# Altium project WL1800-E-D001-PrinterC Rev.2.0.PrjPCB
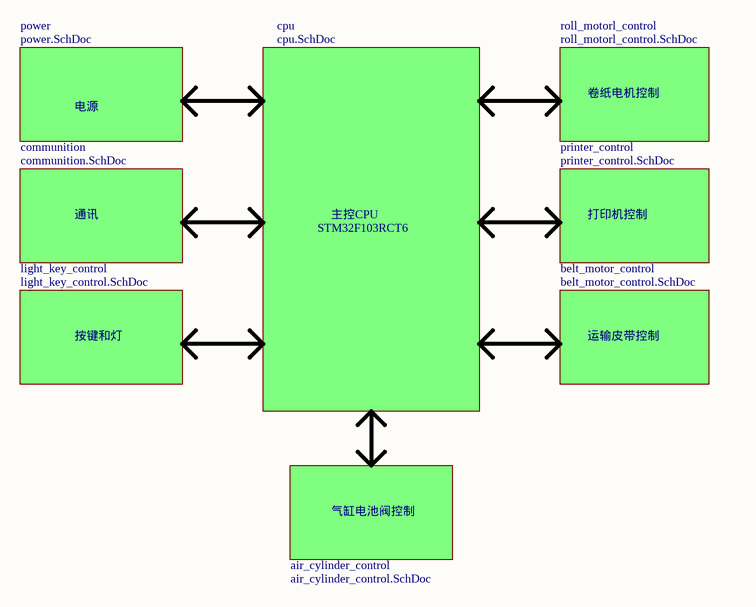
[diagram p0: WL1800-E-D001-PrinterC Rev.2.0.SchDoc]
9 sheets, 280 parts. Net scope: global (net labels, ports and power ports of the same name join across sheets).
Board file: WL1800-E-D001-PrinterC Rev.2.0.PcbDoc
Sheets:
  WL1800-E-D001-PrinterC Rev.2.0.SchDoc
    cpu = cpu.SchDoc
    roll_motorl_control = roll_motorl_control.SchDoc
    belt_motor_control = belt_motor_control.SchDoc
    communition = communition.SchDoc
    printer_control = printer_control.SchDoc
    light_key_control = light_key_control.SchDoc
    power = power.SchDoc
    air_cylinder_control = air_cylinder_control.SchDoc

## Sheet WL1800-E-D001-PrinterC Rev.2.0.SchDoc
size A4; DocumentNumber: 1; Revision: V1.0; SheetNumber: 1; SheetTotal: 9

### Sub-sheets
air_cylinder_control = air_cylinder_control.SchDoc: no entries
belt_motor_control = belt_motor_control.SchDoc: no entries
communition = communition.SchDoc: no entries
cpu = cpu.SchDoc: no entries
light_key_control = light_key_control.SchDoc: no entries
power = power.SchDoc: no entries
printer_control = printer_control.SchDoc: no entries
roll_motorl_control = roll_motorl_control.SchDoc: no entries

### Notes on the sheet
- 电源
- 卷纸电机控制
- 通讯
- STM32F103RCT6
- 主控CPU
- 打印机控制
- 按键和灯
- 运输皮带控制
- 气缸电池阀控制
- :

## Sheet cpu.SchDoc
size A3; DocumentNumber: 3; Revision: V1.0; SheetNumber: 3; SheetTotal: 9
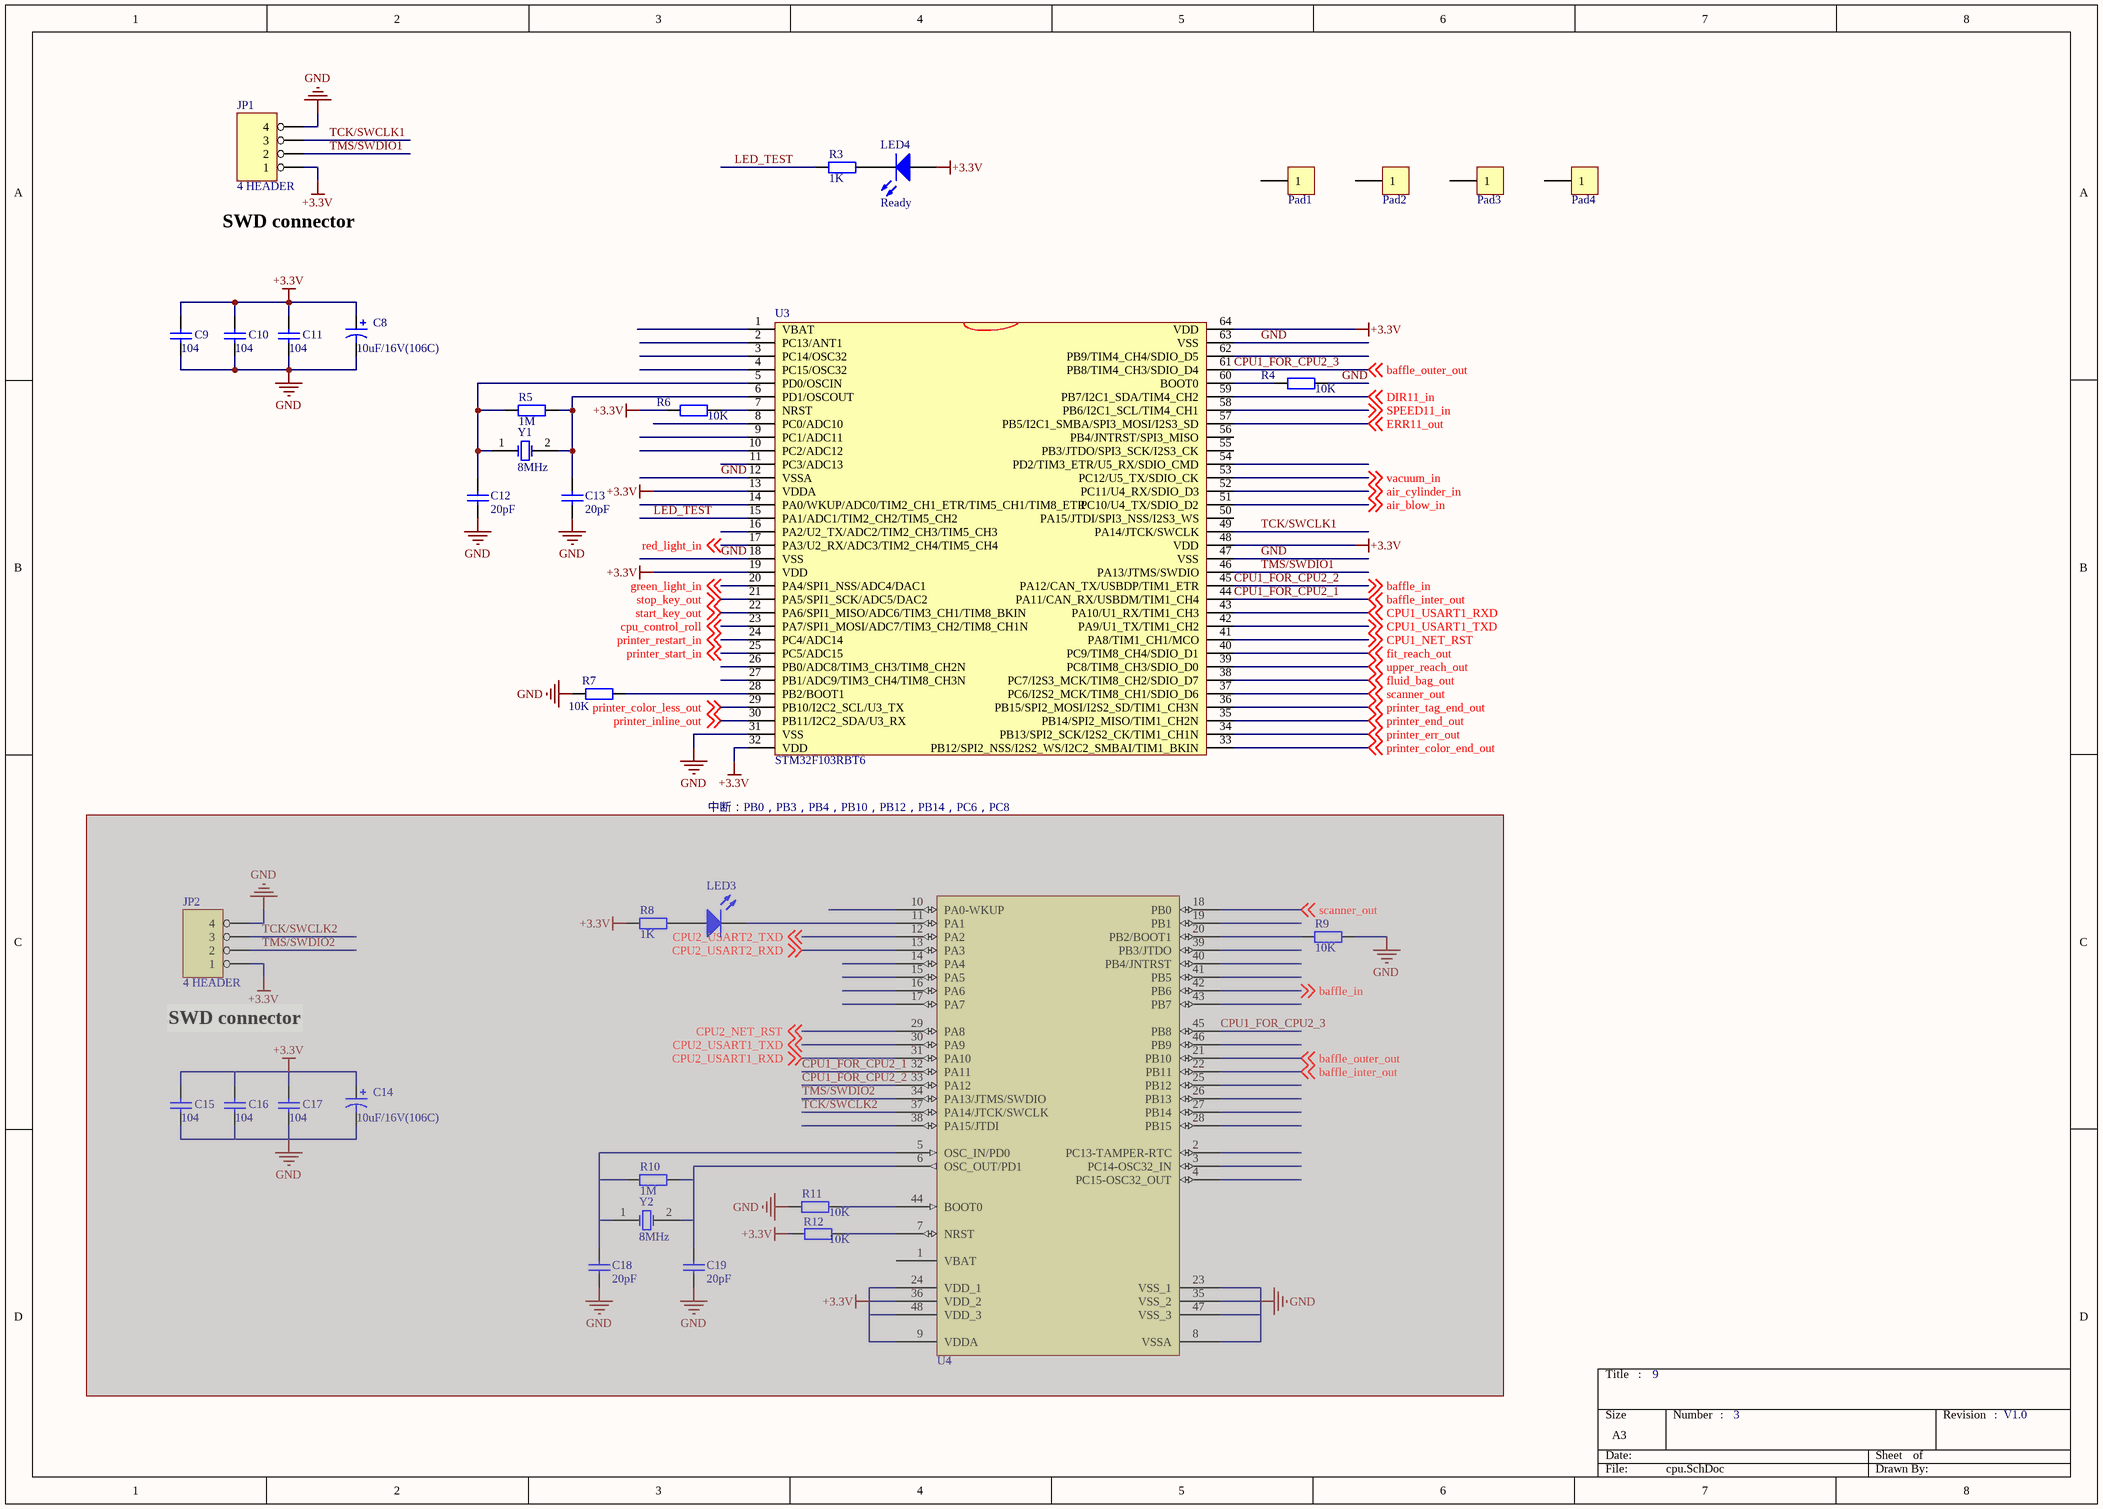
[diagram p1: cpu.SchDoc]

### Parts
(Parts that share a designator on the sheet are numbered #1, #2 ... from top to bottom, then left to right.)
C8  value 10uF/16V(106C)  [CAP A-3216]  (hidden comment: Cap Pol3)
C9  value 104  [0805]  (hidden comment: Cap)
C10  value 104  [0805]  (hidden comment: Cap)
C11  value 104  [0805]  (hidden comment: Cap)
C12  value 20pF  [0805]  (hidden comment: Cap)
C13  value 20pF  [0805]  (hidden comment: Cap)
C14  value 10uF/16V(106C)  [CAP A-3216]  (hidden comment: Cap Pol3)  (masked out: inside a compile mask, not in the netlist)
C15  value 104  [0805]  (hidden comment: Cap)  (masked out: inside a compile mask, not in the netlist)
C16  value 104  [0805]  (hidden comment: Cap)  (masked out: inside a compile mask, not in the netlist)
C17#1  value 104  [0805]  (hidden comment: Cap)  (masked out: inside a compile mask, not in the netlist)
C18#1  value 20pF  [0805]  (hidden comment: Cap)  (masked out: inside a compile mask, not in the netlist)
C19#1  value 20pF  [0805]  (hidden comment: Cap)  (masked out: inside a compile mask, not in the netlist)
JP1  4 HEADER  [CON4_1.5]
JP2  4 HEADER  [CON4_1.5]  (masked out: inside a compile mask, not in the netlist)
LED3  (no value)  [LED-0805]  (masked out: inside a compile mask, not in the netlist)
LED4  Ready  [LED-0805]
Pad1  Pad  [pad35]  (value not drawn)
Pad2  Pad  [pad35]  (value not drawn)
Pad3  Pad  [pad35]  (value not drawn)
Pad4  Pad  [pad35]  (value not drawn)
R3  value 1K  [0805]  (hidden comment: Res2)
R4  value 10K  [0805]  (hidden comment: Res2)
R5  value 1M  [0805]  (hidden comment: Res2)
R6  value 10K  [0805]  (hidden comment: Res2)
R7  value 10K  [0805]  (hidden comment: Res2)
R8  value 1K  [0805]  (hidden comment: Res2)  (masked out: inside a compile mask, not in the netlist)
R9#1  value 10K  [0805]  (hidden comment: Res2)  (masked out: inside a compile mask, not in the netlist)
R10  value 1M  [0805]  (hidden comment: Res2)  (masked out: inside a compile mask, not in the netlist)
R11#1  value 10K  [0805]  (hidden comment: Res2)  (masked out: inside a compile mask, not in the netlist)
R12#1  value 10K  [0805]  (hidden comment: Res2)  (masked out: inside a compile mask, not in the netlist)
U3  STM32F103RBT6  [LQFP64]
U4  STM32F103C8T6  [LQFP48]  (value not drawn)  (masked out: inside a compile mask, not in the netlist)
Y1  8MHz  [XTAL_US]
Y2  8MHz  [XTAL_US]  (masked out: inside a compile mask, not in the netlist)

### Nets
+3.3V: C8.1 C9.2 C10.2 C11.2 JP1.1 LED4.1(A) R6.1 U3.13(VDDA) U3.19(VDD) U3.32(VDD) U3.48(VDD) U3.64(VDD)
GND: C8.2 C9.1 C10.1 C11.1 C12.1 C13.1 JP1.4 R4.2 R7.1 U3.12(VSSA) U3.18(VSS) U3.31(VSS) U3.47(VSS) U3.63(VSS)
air_blow_in: U3.51(PC10/U4_TX/SDIO_D2) ; off-sheet air_blow_in
air_cylinder_in: U3.52(PC11/U4_RX/SDIO_D3) ; off-sheet air_cylinder_in
CPU1_FOR_CPU2_1: U3.44(PA11/CAN_RX/USBDM/TIM1_CH4) ; off-sheet baffle_inter_out  [also labelled baffle_inter_out]
CPU1_FOR_CPU2_2: U3.45(PA12/CAN_TX/USBDP/TIM1_ETR) ; off-sheet baffle_in  [also labelled baffle_in]
CPU1_FOR_CPU2_3: U3.61(PB8/TIM4_CH3/SDIO_D4) ; off-sheet baffle_outer_out  [also labelled baffle_outer_out]
CPU1_NET_RST: U3.41(PA8/TIM1_CH1/MCO) ; off-sheet CPU1_NET_RST
CPU1_USART1_RXD: U3.43(PA10/U1_RX/TIM1_CH3) ; off-sheet CPU1_USART1_RXD
CPU1_USART1_TXD: U3.42(PA9/U1_TX/TIM1_CH2) ; off-sheet CPU1_USART1_TXD
cpu_control_roll: U3.23(PA7/SPI1_MOSI/ADC7/TIM3_CH2/TIM8_CH1N) ; off-sheet cpu_control_roll
DIR11_in: U3.59(PB7/I2C1_SDA/TIM4_CH2) ; off-sheet DIR11_in
ERR11_out: U3.57(PB5/I2C1_SMBA/SPI3_MOSI/I2S3_SD) ; off-sheet ERR11_out
fit_reach_out: U3.40(PC9/TIM8_CH4/SDIO_D1) ; off-sheet fit_reach_out
fluid_bag_out: U3.38(PC7/I2S3_MCK/TIM8_CH2/SDIO_D7) ; off-sheet fluid_bag_out
green_light_in: U3.20(PA4/SPI1_NSS/ADC4/DAC1) ; off-sheet green_light_in
LED_TEST: R3.1 U3.15(PA1/ADC1/TIM2_CH2/TIM5_CH2)
printer_color_end_out: U3.33(PB12/SPI2_NSS/I2S2_WS/I2C2_SMBAI/TIM1_BKIN) ; off-sheet printer_color_end_out
printer_color_less_out: U3.29(PB10/I2C2_SCL/U3_TX) ; off-sheet printer_color_less_out
printer_end_out: U3.35(PB14/SPI2_MISO/TIM1_CH2N) ; off-sheet printer_end_out
printer_err_out: U3.34(PB13/SPI2_SCK/I2S2_CK/TIM1_CH1N) ; off-sheet printer_err_out
printer_inline_out: U3.30(PB11/I2C2_SDA/U3_RX) ; off-sheet printer_inline_out
printer_restart_in: U3.24(PC4/ADC14) ; off-sheet printer_restart_in
printer_start_in: U3.25(PC5/ADC15) ; off-sheet printer_start_in
printer_tag_end_out: U3.36(PB15/SPI2_MOSI/I2S2_SD/TIM1_CH3N) ; off-sheet printer_tag_end_out
red_light_in: U3.17(PA3/U2_RX/ADC3/TIM2_CH4/TIM5_CH4) ; off-sheet red_light_in
scanner_out: U3.37(PC6/I2S2_MCK/TIM8_CH1/SDIO_D6) ; off-sheet scanner_out
SPEED11_in: U3.58(PB6/I2C1_SCL/TIM4_CH1) ; off-sheet SPEED11_in
start_key_out: U3.22(PA6/SPI1_MISO/ADC6/TIM3_CH1/TIM8_BKIN) ; off-sheet start_key_out
stop_key_out: U3.21(PA5/SPI1_SCK/ADC5/DAC2) ; off-sheet stop_key_out
TCK/SWCLK1: JP1.3 U3.49(PA14/JTCK/SWCLK)
TMS/SWDIO1: JP1.2 U3.46(PA13/JTMS/SWDIO)
upper_reach_out: U3.39(PC8/TIM8_CH3/SDIO_D0) ; off-sheet upper_reach_out
vacuum_in: U3.53(PC12/U5_TX/SDIO_CK) ; off-sheet vacuum_in
NetC12_2: C12.2 R5.1 U3.5(PD0/OSCIN) Y1.1(OSC1)
NetC13_2: C13.2 R5.2 U3.6(PD1/OSCOUT) Y1.2(OSC2)
NetLED4_2: LED4.2(K) R3.2
NetR4_1: R4.1 U3.60(BOOT0)
NetR6_2: R6.2 U3.7(NRST)
NetR7_2: R7.2 U3.28(PB2/BOOT1)

Not connected (* = marked no-connect by the designer): Pad1 1; Pad2 1; Pad3 1; Pad4 1; U3 1(VBAT) 2(PC13/ANT1) 3(PC14/OSC32) 4(PC15/OSC32) 8(PC0/ADC10) 9(PC1/ADC11) 10(PC2/ADC12) 11(PC3/ADC13) 14(PA0/WKUP/ADC0/TIM2_CH1_ETR/TIM5_CH1/TIM8_ETR) 16(PA2/U2_TX/ADC2/TIM2_CH3/TIM5_CH3) 26(PB0/ADC8/TIM3_CH3/TIM8_CH2N) 27(PB1/ADC9/TIM3_CH4/TIM8_CH3N) 50(PA15/JTDI/SPI3_NSS/I2S3_WS) 54(PD2/TIM3_ETR/U5_RX/SDIO_CMD) 55(PB3/JTDO/SPI3_SCK/I2S3_CK) 56(PB4/JNTRST/SPI3_MISO) 62(PB9/TIM4_CH4/SDIO_D5)

### Notes on the sheet
- (near JP1) SWD connector
- 中断：PB0，PB3，PB4，PB10，PB12，PB14，PC6，PC8
- (near JP2) SWD connector
- :

### Library data of the parts
C8 C14 = Cap Pol3: Polarized Capacitor (Surface Mount); Published: 8-Jun-2000; LatestRevisionDate: 17-Jul-2002; LatestRevisionNote: Re-released for DXP Platform.; PackageReference: C0805; Publisher: Altium Limited
C9-C13 C15 C16 C17#1 C18#1 C19#1 = Cap: Capacitor; Published: 8-Jun-2000; LatestRevisionDate: 17-Jul-2002; LatestRevisionNote: Re-released for DXP Platform.; Publisher: Altium Limited
  C9-C11 C15 C16 C17#1: PackageReference: RAD-0.3
JP1 JP2 = 4 HEADER: 4 Pin Header
LED3 LED4 = LED2: Typical RED, GREEN, YELLOW, AMBER GaAs LED; Published: 8-Jun-2000; LatestRevisionDate: 17-Jul-2002; LatestRevisionNote: Re-released for DXP Platform.; PackageDocument: Feb-2002; PackageReference: 3.2X1.6X1.1; Publisher: Altium Limited
R3-R8 R9#1 R10 R11#1 R12#1 = Res2: Resistor; Published: 8-Jun-2000; LatestRevisionDate: 17-Jul-2002; LatestRevisionNote: Re-released for DXP Platform.; Publisher: Altium Limited
  R3 R8: PackageReference: AXIAL-0.4
U3 = STM32F103RDT6
Y1 Y2 = XTAL: Crystal Oscillator; Published: 8-Jun-2000; LatestRevisionDate: 17-Jul-2002; LatestRevisionNote: Re-released for DXP Platform.; Publisher: Altium Limited

## Sheet roll_motorl_control.SchDoc
size A3; DocumentNumber: 7; Revision: V1.0; SheetNumber: 7; SheetTotal: 9
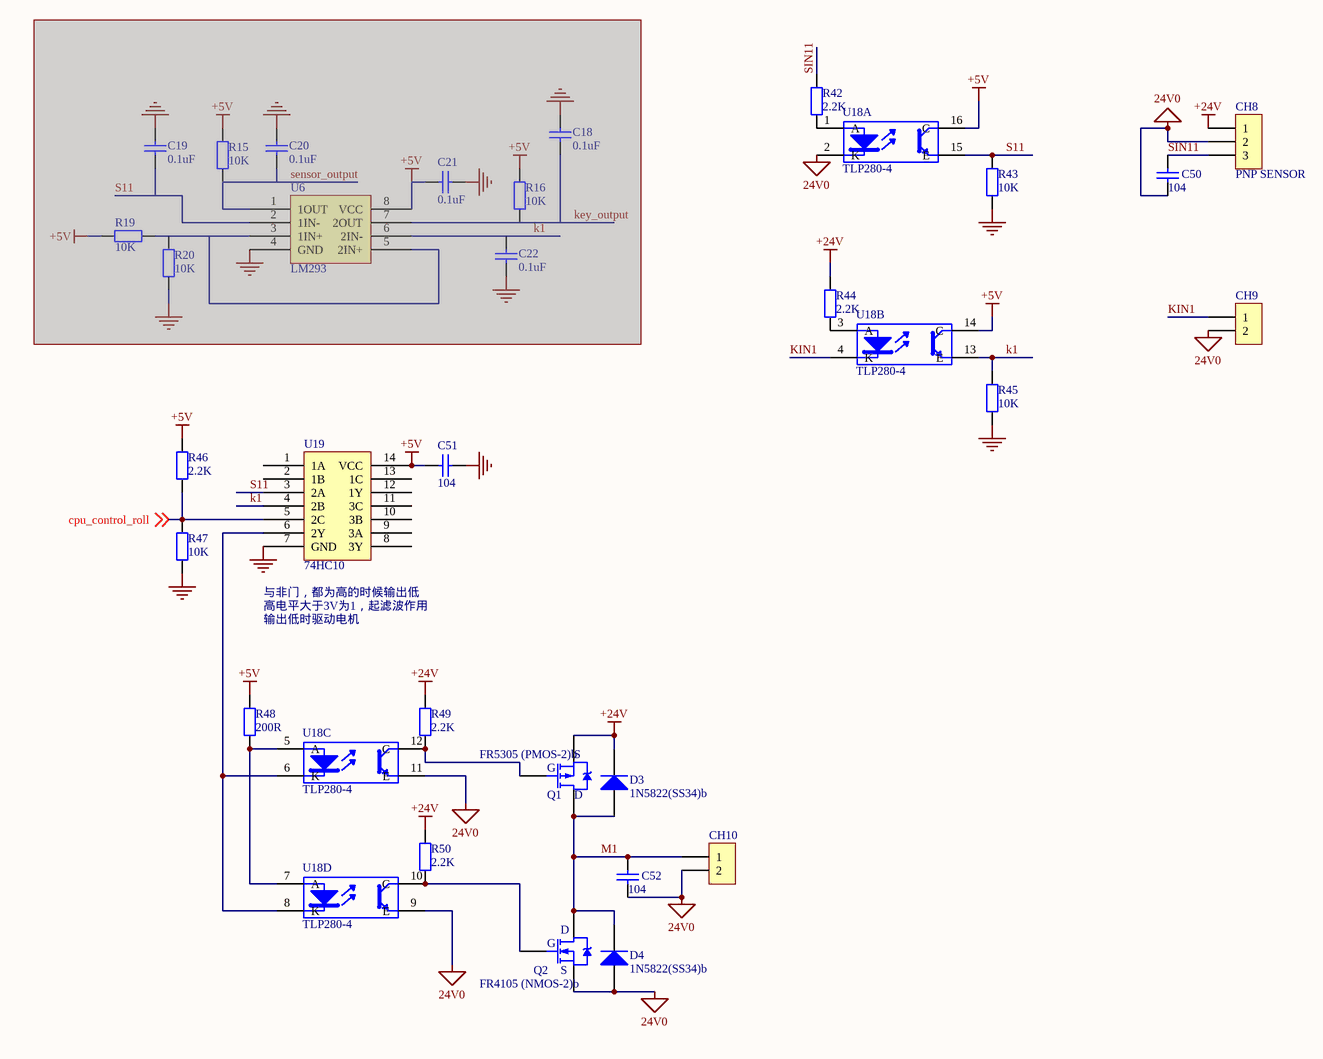
[diagram p2: roll_motorl_control.SchDoc]

### Parts
(Parts that share a designator on the sheet are numbered #1, #2 ... from top to bottom, then left to right.)
C18#2  value 0.1uF  [0805]  (hidden comment: Cap)  (masked out: inside a compile mask, not in the netlist)
C19#2  value 0.1uF  [0805]  (hidden comment: Cap)  (masked out: inside a compile mask, not in the netlist)
C20#1  value 0.1uF  [0805]  (hidden comment: Cap)  (masked out: inside a compile mask, not in the netlist)
C21#1  value 0.1uF  [0805]  (hidden comment: Cap)  (masked out: inside a compile mask, not in the netlist)
C22#1  value 0.1uF  [0805]  (hidden comment: Cap)  (masked out: inside a compile mask, not in the netlist)
C50  value 104  [0805]  (hidden comment: Capb)
C51  value 104  [0805]  (hidden comment: Cap)
C52  value 104  [0805]  (hidden comment: Capb)
CH8  HEADER1X3  [CH3.96-3PIN]  (value not drawn)
CH9  HEADER1X2  [CH3.96-2PIN]  (value not drawn)
CH10  HEADER1X2  [CH3.96-2PIN]  (value not drawn)
D3  1N5822(SS34)b  [SMA]
D4  1N5822(SS34)b  [SMA]
Q1  FR5305 (PMOS-2)b  [TO-252]
Q2  FR4105 (NMOS-2)b  [TO-252]
R15#1  value 10K  [0805]  (hidden comment: Res2)  (masked out: inside a compile mask, not in the netlist)
R16#1  value 10K  [0805]  (hidden comment: Res2)  (masked out: inside a compile mask, not in the netlist)
R19#1  value 10K  [0805]  (hidden comment: Res2)  (masked out: inside a compile mask, not in the netlist)
R20#1  value 10K  [0805]  (hidden comment: Res2)  (masked out: inside a compile mask, not in the netlist)
R42  value 2.2K  [0805]  (hidden comment: Res2)
R43  value 10K  [0805]  (hidden comment: Res2)
R44  value 2.2K  [0805]  (hidden comment: Res2)
R45  value 10K  [0805]  (hidden comment: Res2)
R46  value 2.2K  [0805]  (hidden comment: Res2)
R47  value 10K  [0805]  (hidden comment: Res2)
R48  value 200R  [0805]  (hidden comment: Res2)
R49  value 2.2K  [0805]  (hidden comment: Res2)
R50  value 2.2K  [0805]  (hidden comment: Res2)
U6#1  LM293  [SOP8-OP27]  (masked out: inside a compile mask, not in the netlist)
U18  TLP280-4  [SO16]  (parts A,B,C,D of 4)
U19  74HC10  [SO14]

### Nets
24V0: C50.1 C52.1 CH8.2 CH9.2 CH10.2 D4.1(A) Q2.3(S) U18.2(K) U18.9(E) U18.11(E)
+5V: C51.2 R46.1 R48.1 U18.14(C) U18.16(C) U19.14(VCC)
+24V: CH8.1 D3.2(K) Q1.3(S) R44.1 R49.1 R50.1
GND: C51.1 R43.2 R45.2 R47.2 U19.7(GND)
cpu_control_roll: R46.2 R47.1 U19.5(2C) ; off-sheet cpu_control_roll
k1: R45.1 U18.13(E) U19.4(2B)
KIN1: CH9.1 U18.4(K)
M1: C52.2 CH10.1 D3.1(A) D4.2(K) Q1.2(D) Q2.2(D)
S11: R43.1 U18.15(E) U19.3(2A)
SIN11: C50.2 CH8.3 R42.1
NetQ1_1: Q1.1(G) R49.2 U18.12(C)
NetQ2_1: Q2.1(G) R50.2 U18.10(C)
NetR42_2: R42.2 U18.1(A)
NetR44_2: R44.2 U18.3(A)
NetR48_2: R48.2 U18.5(A) U18.7(A)
NetU18_6: U18.6(K) U18.8(K) U19.6(2Y)

Not connected (* = marked no-connect by the designer): U19 1(1A) 2(1B) 8(3Y) 9(3A) 10(3B) 11(3C) 12(1Y) 13(1C)

### Notes on the sheet
- (near U19) 与非门，都为高的时候输出低
- 高电平大于3V为1，起滤波作用
- 输出低时驱动电机
- (near Q1) G
- (near Q1) S
- (near Q1) D
- (near Q2) G
- (near Q2) D
- (near Q2) S
- :
- (in symbol HEADER1X3) PNP SENSOR

### Library data of the parts
C18#2 C19#2 C20#1 C21#1 C22#1 C50-C52 = Cap: Capacitor; Published: 8-Jun-2000; LatestRevisionDate: 17-Jul-2002; LatestRevisionNote: Re-released for DXP Platform.; PackageReference: RAD-0.3; Publisher: Altium Limited
D3 D4 = Diode 1N4148: High Conductance Fast Diode; Published: 8-Jun-2000; LatestRevisionDate: 17-Jul-2002; LatestRevisionNote: Re-released for DXP Platform.; DatasheetDocument: 1997; PackageReference: DO-35; Publisher: Altium Limited; Code_JEDEC: DO-204-AH; ComponentLink1Description: Manufacturer Link; ComponentLink1URL: http://www.fairchildsemi.com/; ComponentLink2Description: Datasheet; ComponentLink2URL: http://www.fairchildsemi.com/ds/1N%2F1N4148.pdf
Q1 = PMOS-2: P-Channel Power MOSFET; Note: Pin 4 not drawn and electrically connected to Pin 2.; Published: 8-Jun-2000; LatestRevisionDate: 17-Jul-2002; LatestRevisionNote: Re-released for DXP Platform.; DatasheetDocument: PD-9.390D; PackageReference: TO-220AB; Publisher: Altium Limited; Code_JEDEC: TO-220-AB; ComponentLink1Description: Manufacturer Link; ComponentLink1URL: http://www.irf.com/
Q2 = NMOS-2: N-Channel Power MOSFET; Note: Pin 2 is electrically connected to pin 4.; Published: 8-Jun-2000; LatestRevisionDate: 17-Jul-2002; LatestRevisionNote: Re-released for DXP Platform.; DatasheetDocument: PD-9.814; PackageReference: TO-220AB; Publisher: Altium Limited; Code_JEDEC: TO-220-AB; ComponentLink1Description: Manufacturer Link; ComponentLink1URL: http://www.irf.com/
R15#1 R16#1 R19#1 R20#1 R42-R50 = Res2: Resistor; Published: 8-Jun-2000; LatestRevisionDate: 17-Jul-2002; LatestRevisionNote: Re-released for DXP Platform.; PackageReference: AXIAL-0.4; Publisher: Altium Limited
U18 = TLP521-4
U19 = 74HC10: three input nand gain

## Sheet belt_motor_control.SchDoc
size A3; DocumentNumber: 5; Revision: V1.0; SheetNumber: 5; SheetTotal: 9
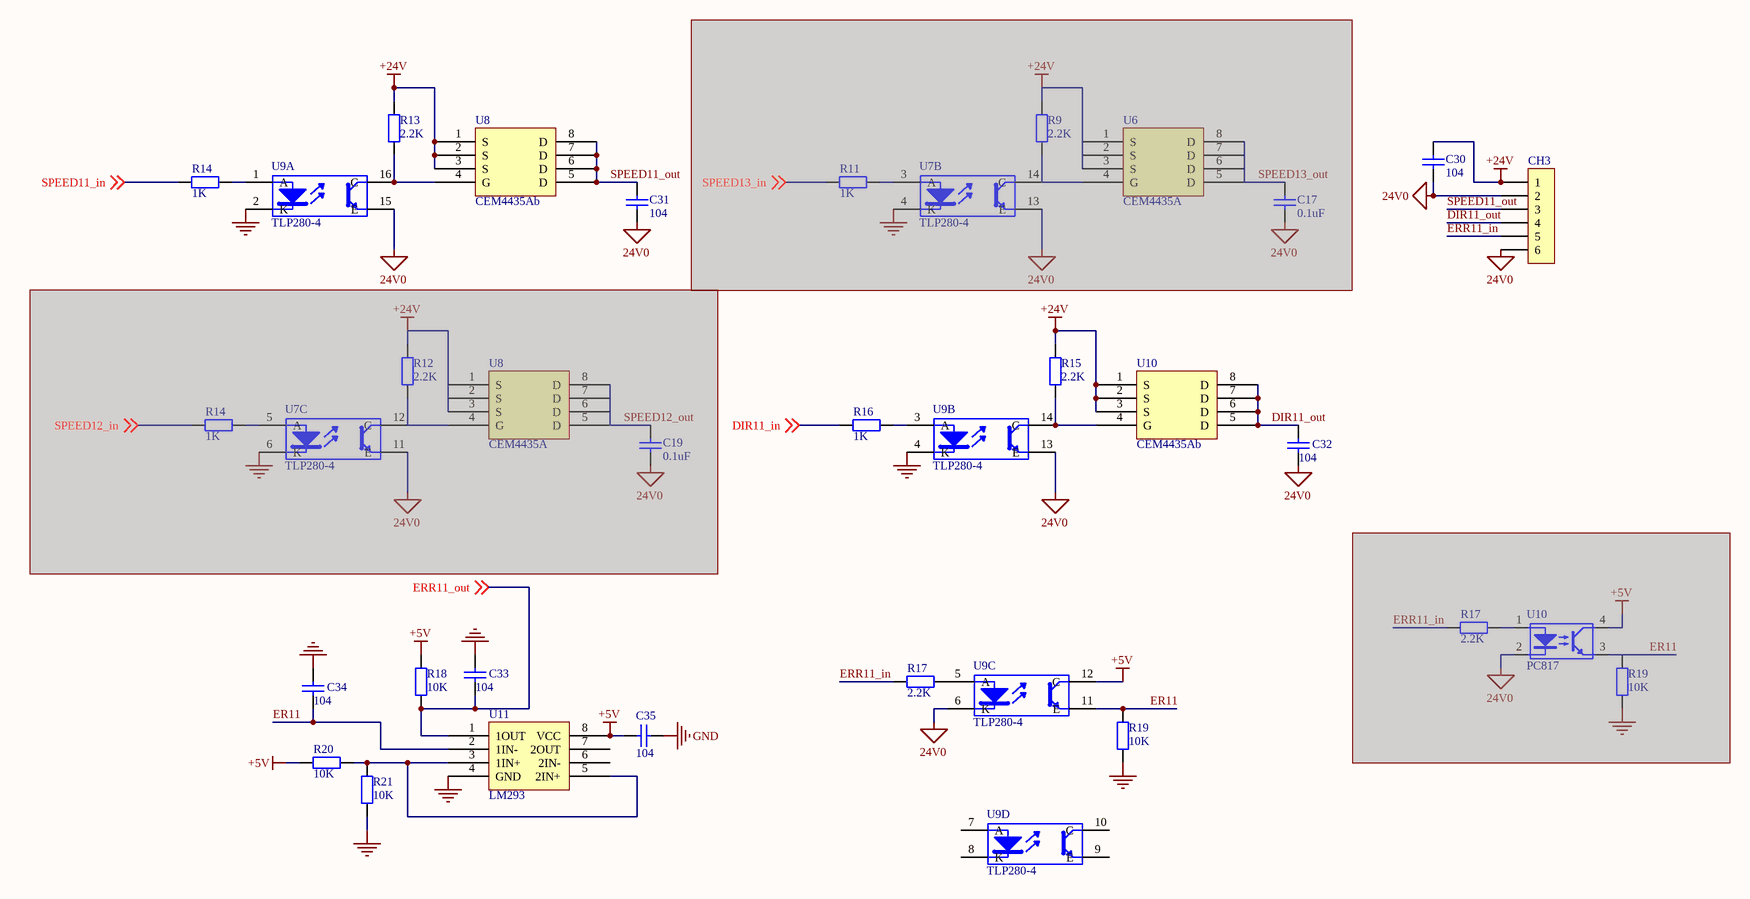
[diagram p3: belt_motor_control.SchDoc]

### Parts
(Parts that share a designator on the sheet are numbered #1, #2 ... from top to bottom, then left to right.)
C17#2  value 0.1uF  [0805]  (hidden comment: Cap)  (masked out: inside a compile mask, not in the netlist)
C19#3  value 0.1uF  [0805]  (hidden comment: Cap)  (masked out: inside a compile mask, not in the netlist)
C30  value 104  [0805]  (hidden comment: Capb)
C31  value 104  [0805]  (hidden comment: Capb)
C32  value 104  [0805]  (hidden comment: Capb)
C33  value 104  [0805]  (hidden comment: Cap)
C34  value 104  [0805]  (hidden comment: Cap)
C35  value 104  [0805]  (hidden comment: Cap)
CH3  HEADER1X6  [CH3.96-6PIN]  (value not drawn)
R9#2  value 2.2K  [0805]  (hidden comment: Res2)  (masked out: inside a compile mask, not in the netlist)
R11#2  value 1K  [0805]  (hidden comment: Res2)  (masked out: inside a compile mask, not in the netlist)
R12#2  value 2.2K  [0805]  (hidden comment: Res2)  (masked out: inside a compile mask, not in the netlist)
R13  value 2.2K  [0805]  (hidden comment: Res2)
R14#1  value 1K  [0805]  (hidden comment: Res2)
R14#2  value 1K  [0805]  (hidden comment: Res2)  (masked out: inside a compile mask, not in the netlist)
R15#2  value 2.2K  [0805]  (hidden comment: Res2)
R16#2  value 1K  [0805]  (hidden comment: Res2)
R17#1  value 2.2K  [0805]  (hidden comment: Res2)  (masked out: inside a compile mask, not in the netlist)
R17#2  value 2.2K  [0805]  (hidden comment: Res2)
R18  value 10K  [0805]  (hidden comment: Res2)
R19#2  value 10K  [0805]  (hidden comment: Res2)  (masked out: inside a compile mask, not in the netlist)
R19#3  value 10K  [0805]  (hidden comment: Res2)
R20#2  value 10K  [0805]  (hidden comment: Res2)
R21  value 10K  [0805]  (hidden comment: Res2)
U6#2  CEM4435A  [SOP8-OP27]  (masked out: inside a compile mask, not in the netlist)
U7#1  TLP280-4  [SO16]  (parts B,C of 4)  (masked out: inside a compile mask, not in the netlist)
U8#1  CEM4435Ab  [SOP8-OP27]
U8#2  CEM4435A  [SOP8-OP27]  (masked out: inside a compile mask, not in the netlist)
U9  TLP280-4  [SO16]  (parts A,B,C,D of 4)
U10#1  CEM4435Ab  [SOP8-OP27]
U10#2  PC817  [SOP4_127]  (masked out: inside a compile mask, not in the netlist)
U11  LM293  [SOP8-OP27]

### Nets
24V0: C30.2 C31.2 C32.1 CH3.2 CH3.6 U9.6(K) U9.13(E) U9.15(E)
+5V: C35.2 R18.1 R20#2.1 U9.12(C) U11.8(VCC)
+24V: C30.1 CH3.1 R13.2 R15#2.1 U8#1.1(S) U8#1.2(S) U8#1.3(S) U10#1.1(S) U10#1.2(S) U10#1.3(S)
GND: C33.2 C34.2 C35.1 R19#3.1 R21.2 U9.2(K) U9.4(K) U11.4(GND)
DIR11_in: R16#2.1 ; off-sheet DIR11_in
DIR11_out: C32.2 CH3.4 U10#1.5(D) U10#1.6(D) U10#1.7(D) U10#1.8(D)
ER11: C34.1 R19#3.2 U9.11(E) U11.2(1IN-)
ERR11_in: CH3.5 R17#2.1
ERR11_out: C33.1 R18.2 U11.1(1OUT) ; off-sheet ERR11_out
SPEED11_in: R14#1.1 ; off-sheet SPEED11_in
SPEED11_out: C31.1 CH3.3 U8#1.5(D) U8#1.6(D) U8#1.7(D) U8#1.8(D)
NetR13_1: R13.1 U8#1.4(G) U9.16(C)
NetR14#1_2: R14#1.2 U9.1(A)
NetR15#2_2: R15#2.2 U9.14(C) U10#1.4(G)
NetR16#2_2: R16#2.2 U9.3(A)
NetR17#2_2: R17#2.2 U9.5(A)
NetR20#2_2: R20#2.2 R21.1 U11.3(1IN+) U11.5(2IN+)

Not connected (* = marked no-connect by the designer): U9 7(A) 8(K) 9(E) 10(C); U11 6(2IN-) 7(2OUT)

### Notes on the sheet
- :

### Library data of the parts
C17#2 C19#3 C30-C35 = Cap: Capacitor; Published: 8-Jun-2000; LatestRevisionDate: 17-Jul-2002; LatestRevisionNote: Re-released for DXP Platform.; PackageReference: RAD-0.3; Publisher: Altium Limited
R9#2 R11#2 R12#2 R13 R14#1 R14#2 R15#2 R16#2 R17#1 R17#2 R18 R19#2 R19#3 R20#2 R21 = Res2: Resistor; Published: 8-Jun-2000; LatestRevisionDate: 17-Jul-2002; LatestRevisionNote: Re-released for DXP Platform.; PackageReference: AXIAL-0.4; Publisher: Altium Limited
U7#1 U9 = TLP521-4
U8#1 U10#1 = CEM4435A

## Sheet communition.SchDoc
size A4; DocumentNumber: 4; Revision: V1.0; SheetNumber: 4; SheetTotal: 9
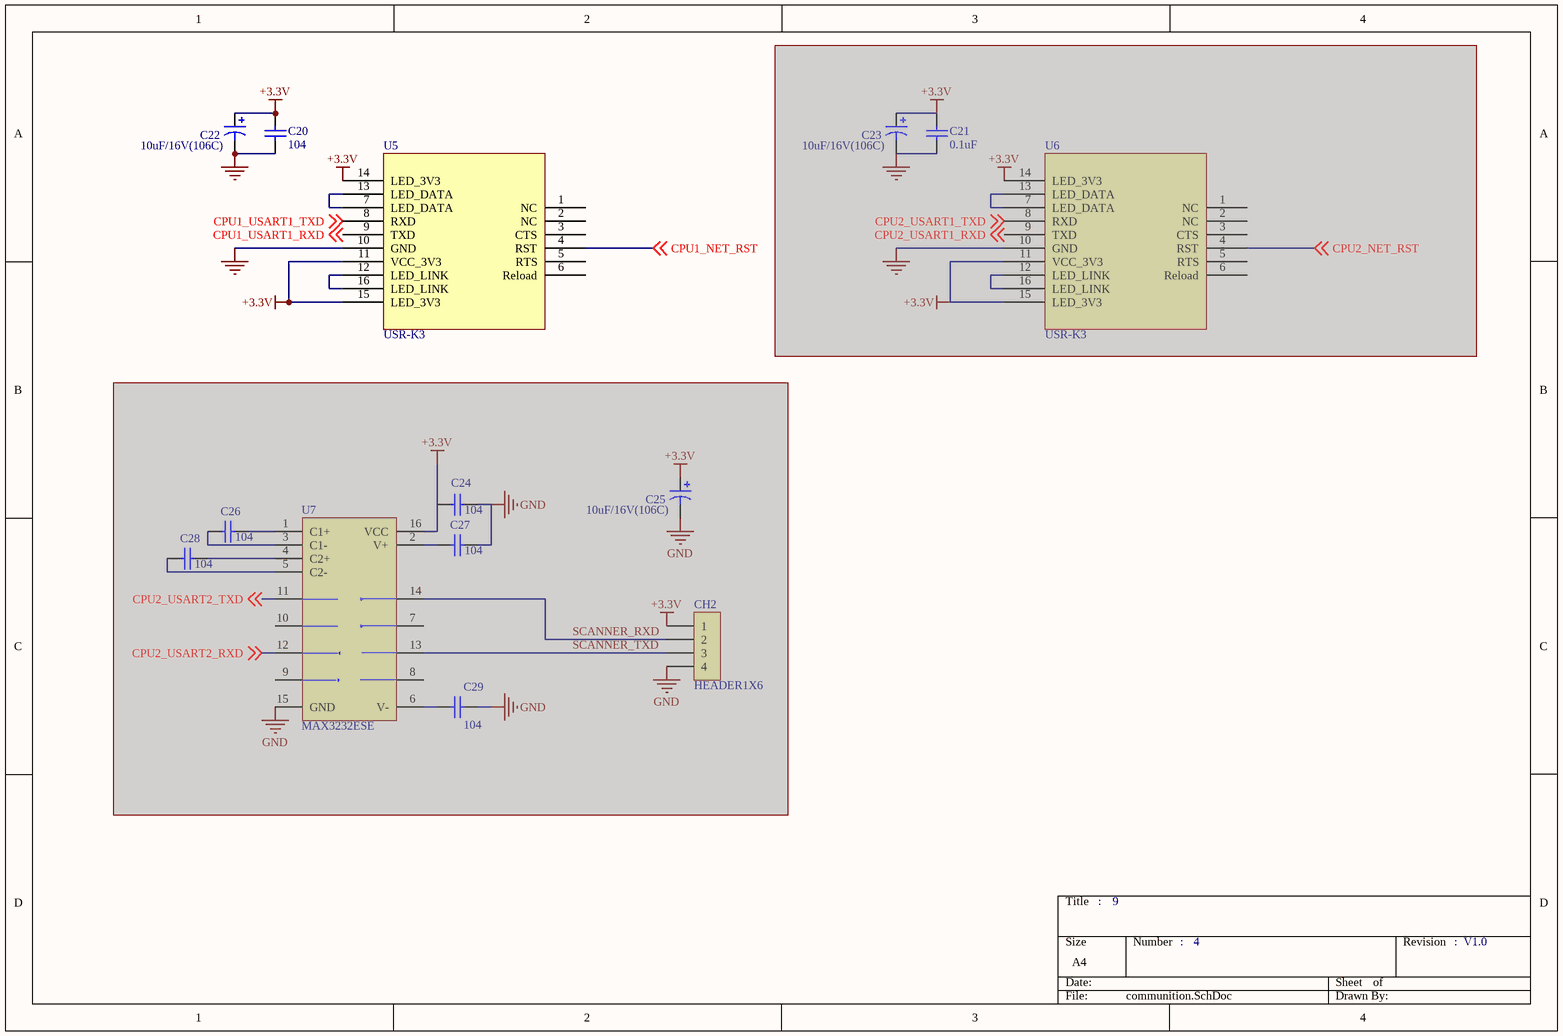
[diagram p4: communition.SchDoc]

### Parts
(Parts that share a designator on the sheet are numbered #1, #2 ... from top to bottom, then left to right.)
C20#2  value 104  [0805]  (hidden comment: Cap)
C21#2  value 0.1uF  [0805]  (hidden comment: Cap)  (masked out: inside a compile mask, not in the netlist)
C22#2  value 10uF/16V(106C)  [CAP A-3216]  (hidden comment: Cap Pol3)
C23  value 10uF/16V(106C)  [CAP A-3216]  (hidden comment: Cap Pol3)  (masked out: inside a compile mask, not in the netlist)
C24  value 104  [0805]  (hidden comment: Cap)  (masked out: inside a compile mask, not in the netlist)
C25  value 10uF/16V(106C)  [CAP A-3216]  (hidden comment: Cap Pol3)  (masked out: inside a compile mask, not in the netlist)
C26  value 104  [0805]  (hidden comment: Cap)  (masked out: inside a compile mask, not in the netlist)
C27  value 104  [0805]  (hidden comment: Cap)  (masked out: inside a compile mask, not in the netlist)
C28  value 104  [0805]  (hidden comment: Cap)  (masked out: inside a compile mask, not in the netlist)
C29  value 104  [0805]  (hidden comment: Cap)  (masked out: inside a compile mask, not in the netlist)
CH2  HEADER1X6  [CH3.96-4PIN]  (masked out: inside a compile mask, not in the netlist)
U5  USR-K3  [USR-K3]
U6#3  USR-K3  [USR-K3]  (masked out: inside a compile mask, not in the netlist)
U7#2  MAX3232ESE  [NSO16_N]  (masked out: inside a compile mask, not in the netlist)

### Nets
+3.3V: C20#2.2 C22#2.1 U5.11(VCC_3V3) U5.14(LED_3V3) U5.15(LED_3V3)
GND: C20#2.1 C22#2.2 U5.10(GND)
CPU1_NET_RST: U5.4(RST) ; off-sheet CPU1_NET_RST
CPU1_USART1_RXD: U5.9(TXD) ; off-sheet CPU1_USART1_RXD
CPU1_USART1_TXD: U5.8(RXD) ; off-sheet CPU1_USART1_TXD
NetU5_7: U5.7(LED_DATA) U5.13(LED_DATA)
NetU5_12: U5.12(LED_LINK) U5.16(LED_LINK)

Not connected (* = marked no-connect by the designer): U5 1(NC) 2(NC) 3(CTS) 5(RTS) 6(Reload)

### Notes on the sheet
- :

### Library data of the parts
C20#2 C21#2 C24 C26-C29 = Cap: Capacitor; Published: 8-Jun-2000; LatestRevisionDate: 17-Jul-2002; LatestRevisionNote: Re-released for DXP Platform.; PackageReference: RAD-0.3; Publisher: Altium Limited
C22#2 C23 C25 = Cap Pol3: Polarized Capacitor (Surface Mount); Published: 8-Jun-2000; LatestRevisionDate: 17-Jul-2002; LatestRevisionNote: Re-released for DXP Platform.; PackageReference: C0805; Publisher: Altium Limited
CH2 = HEADER1X4

## Sheet printer_control.SchDoc
size A2; DocumentNumber: 8; Revision: V1.0; SheetNumber: 8; SheetTotal: 9
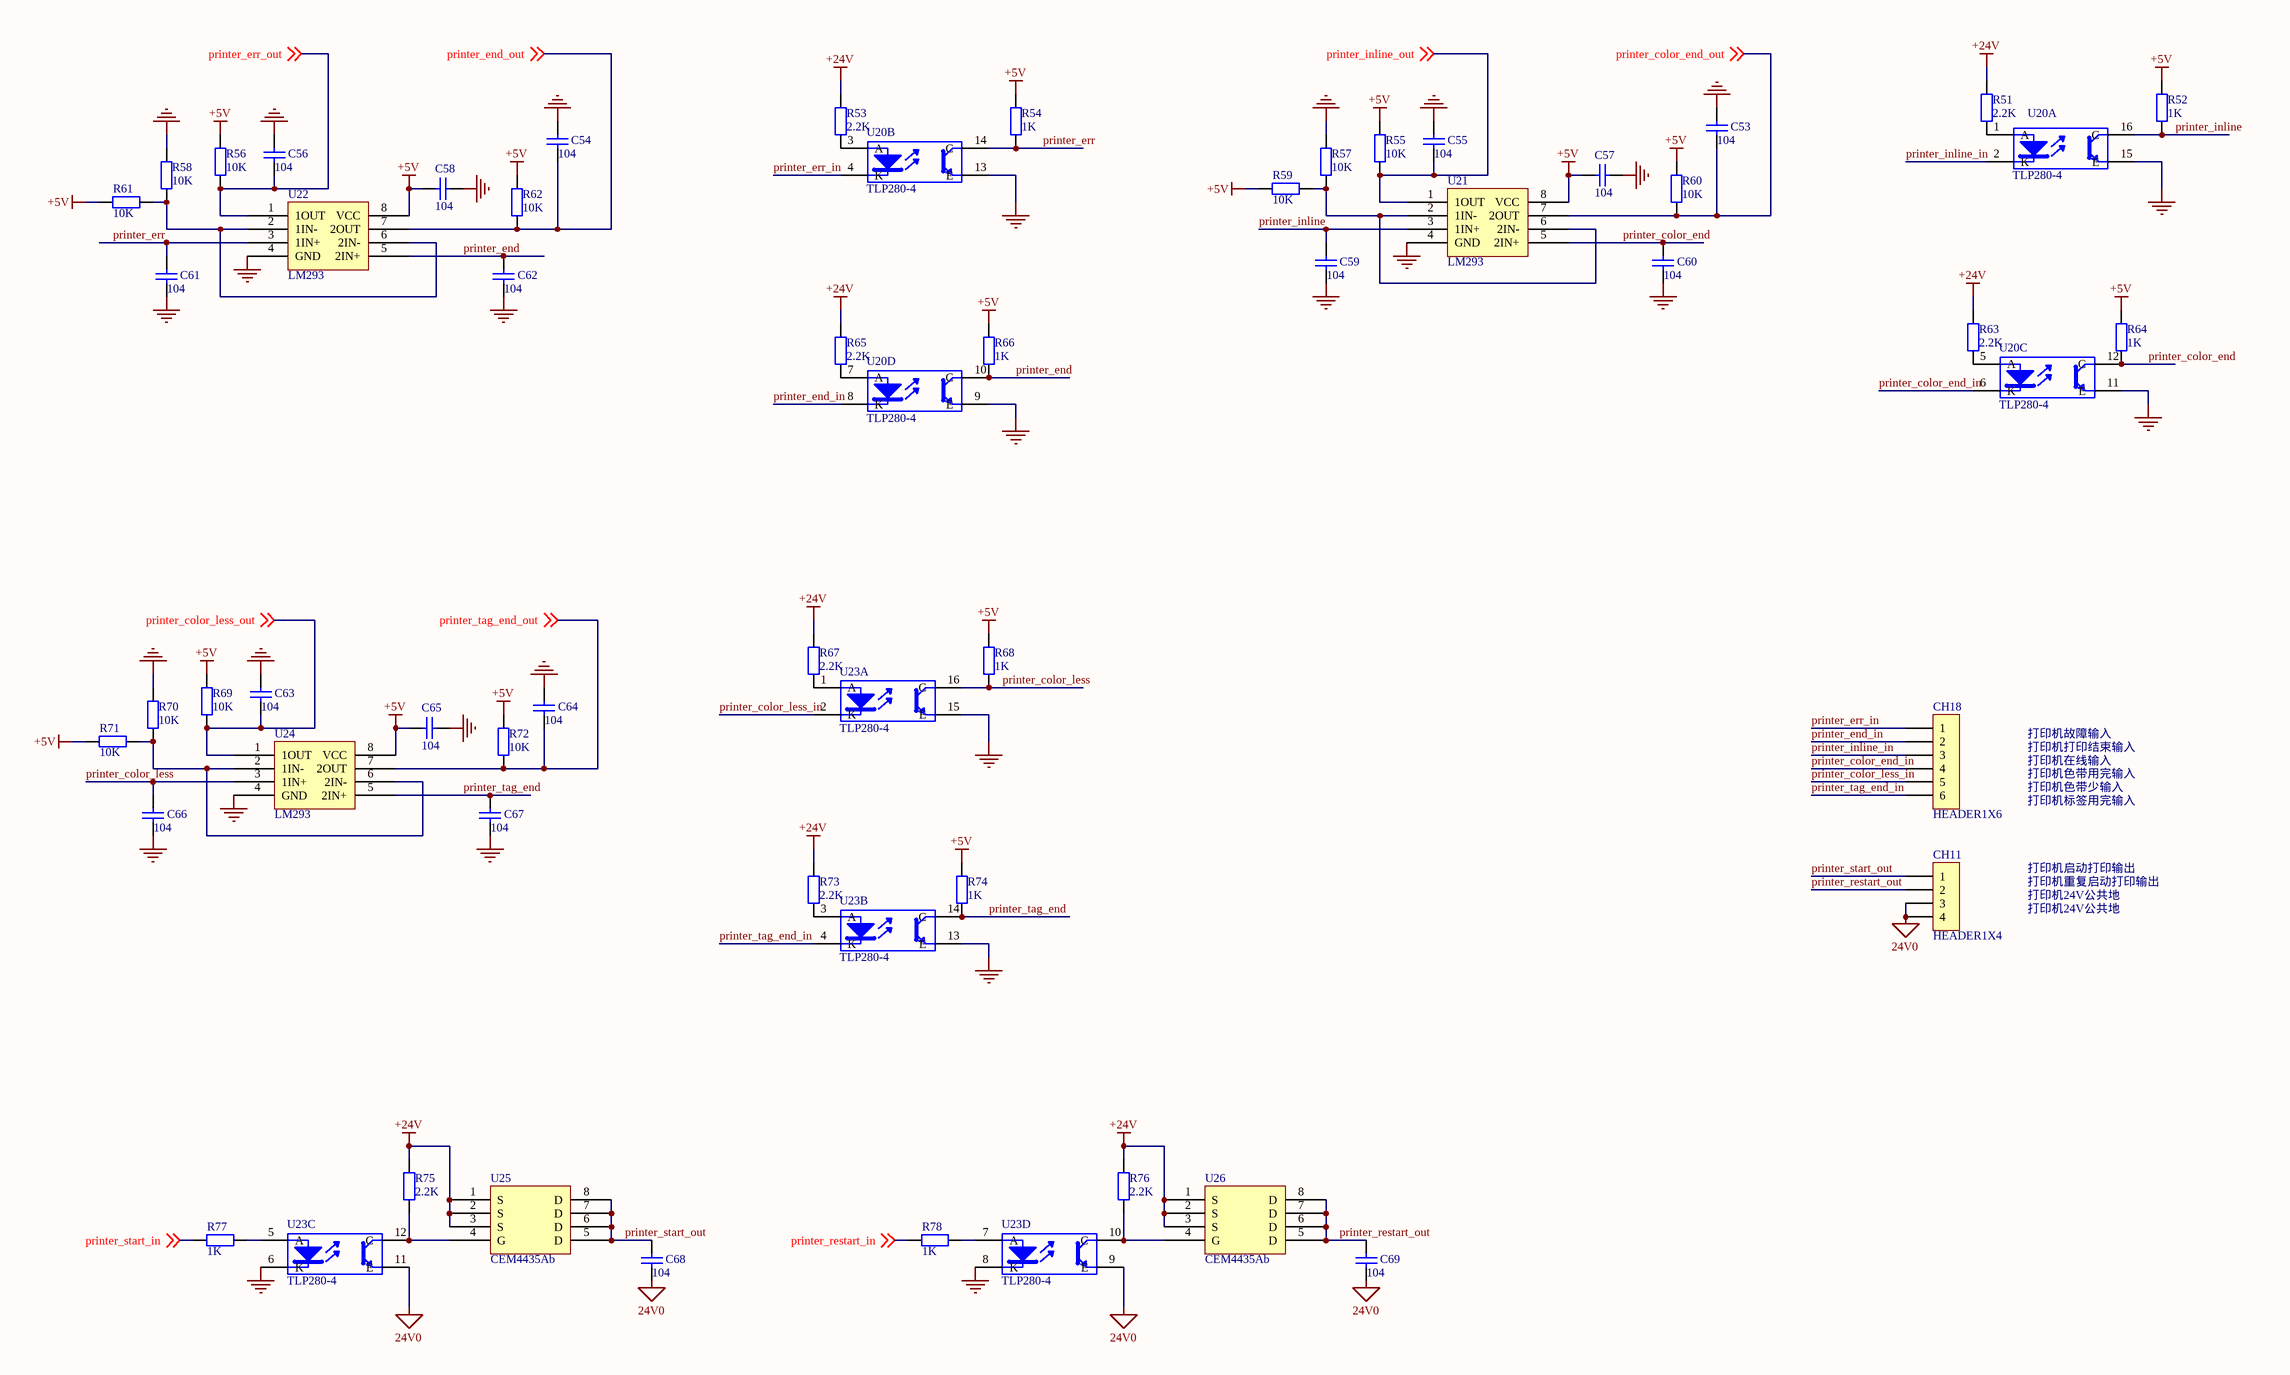
[diagram p5: printer_control.SchDoc]

### Parts
C53  value 104  [0805]  (hidden comment: Cap)
C54  value 104  [0805]  (hidden comment: Cap)
C55  value 104  [0805]  (hidden comment: Cap)
C56  value 104  [0805]  (hidden comment: Cap)
C57  value 104  [0805]  (hidden comment: Cap)
C58  value 104  [0805]  (hidden comment: Cap)
C59  value 104  [0805]  (hidden comment: Cap)
C60  value 104  [0805]  (hidden comment: Cap)
C61  value 104  [0805]  (hidden comment: Cap)
C62  value 104  [0805]  (hidden comment: Cap)
C63  value 104  [0805]  (hidden comment: Cap)
C64  value 104  [0805]  (hidden comment: Cap)
C65  value 104  [0805]  (hidden comment: Cap)
C66  value 104  [0805]  (hidden comment: Cap)
C67  value 104  [0805]  (hidden comment: Cap)
C68  value 104  [0805]  (hidden comment: Capb)
C69  value 104  [0805]  (hidden comment: Capb)
CH11  HEADER1X4  [CH3.96-4PIN]
CH18  HEADER1X6  [CH3.96-6PIN]
R51  value 2.2K  [0805]  (hidden comment: Res2)
R52  value 1K  [0805]  (hidden comment: Res2)
R53  value 2.2K  [0805]  (hidden comment: Res2)
R54  value 1K  [0805]  (hidden comment: Res2)
R55  value 10K  [0805]  (hidden comment: Res2)
R56  value 10K  [0805]  (hidden comment: Res2)
R57  value 10K  [0805]  (hidden comment: Res2)
R58  value 10K  [0805]  (hidden comment: Res2)
R59  value 10K  [0805]  (hidden comment: Res2)
R60  value 10K  [0805]  (hidden comment: Res2)
R61  value 10K  [0805]  (hidden comment: Res2)
R62  value 10K  [0805]  (hidden comment: Res2)
R63  value 2.2K  [0805]  (hidden comment: Res2)
R64  value 1K  [0805]  (hidden comment: Res2)
R65  value 2.2K  [0805]  (hidden comment: Res2)
R66  value 1K  [0805]  (hidden comment: Res2)
R67  value 2.2K  [0805]  (hidden comment: Res2)
R68  value 1K  [0805]  (hidden comment: Res2)
R69  value 10K  [0805]  (hidden comment: Res2)
R70  value 10K  [0805]  (hidden comment: Res2)
R71  value 10K  [0805]  (hidden comment: Res2)
R72  value 10K  [0805]  (hidden comment: Res2)
R73  value 2.2K  [0805]  (hidden comment: Res2)
R74  value 1K  [0805]  (hidden comment: Res2)
R75  value 2.2K  [0805]  (hidden comment: Res2)
R76  value 2.2K  [0805]  (hidden comment: Res2)
R77  value 1K  [0805]  (hidden comment: Res2)
R78  value 1K  [0805]  (hidden comment: Res2)
U20  TLP280-4  [SO16]  (parts A,B,C,D of 4)
U21  LM293  [SOP8-OP27]
U22  LM293  [SOP8-OP27]
U23  TLP280-4  [SO16]  (parts A,B,C,D of 4)
U24  LM293  [SOP8-OP27]
U25  CEM4435Ab  [SOP8-OP27]
U26  CEM4435Ab  [SOP8-OP27]

### Nets
24V0: C68.1 C69.1 CH11.3 CH11.4 U23.9(E) U23.11(E)
+5V: C57.2 C58.2 C65.2 R52.1 R54.1 R55.1 R56.1 R59.1 R60.1 R61.1 R62.1 R64.1 R66.1 R68.1 R69.1 R71.1 R72.1 R74.1 U21.8(VCC) U22.8(VCC) U24.8(VCC)
+24V: R51.1 R53.1 R63.1 R65.1 R67.1 R73.1 R75.1 R76.1 U25.1(S) U25.2(S) U25.3(S) U26.1(S) U26.2(S) U26.3(S)
GND: C53.2 C54.2 C55.2 C56.2 C57.1 C58.1 C59.1 C60.1 C61.1 C62.1 C63.2 C64.2 C65.1 C66.1 C67.1 R57.1 R58.1 R70.1 U20.9(E) U20.11(E) U20.13(E) U20.15(E) U21.4(GND) U22.4(GND) U23.6(K) U23.8(K) U23.13(E) U23.15(E) U24.4(GND)
printer_color_end: C60.2 R64.2 U20.12(C) U21.5(2IN+)
printer_color_end_in: CH18.4 U20.6(K)
printer_color_end_out: C53.1 R60.2 U21.7(2OUT) ; off-sheet printer_color_end_out
printer_color_less: C66.2 R68.2 U23.16(C) U24.3(1IN+)
printer_color_less_in: CH18.5 U23.2(K)
printer_color_less_out: C63.1 R69.2 U24.1(1OUT) ; off-sheet printer_color_less_out
printer_end: C62.2 R66.2 U20.10(C) U22.5(2IN+)
printer_end_in: CH18.2 U20.8(K)
printer_end_out: C54.1 R62.2 U22.7(2OUT) ; off-sheet printer_end_out
printer_err: C61.2 R54.2 U20.14(C) U22.3(1IN+)
printer_err_in: CH18.1 U20.4(K)
printer_err_out: C56.1 R56.2 U22.1(1OUT) ; off-sheet printer_err_out
printer_inline: C59.2 R52.2 U20.16(C) U21.3(1IN+)
printer_inline_in: CH18.3 U20.2(K)
printer_inline_out: C55.1 R55.2 U21.1(1OUT) ; off-sheet printer_inline_out
printer_restart_in: R78.1 ; off-sheet printer_restart_in
printer_restart_out: C69.2 CH11.2 U26.5(D) U26.6(D) U26.7(D) U26.8(D)
printer_start_in: R77.1 ; off-sheet printer_start_in
printer_start_out: C68.2 CH11.1 U25.5(D) U25.6(D) U25.7(D) U25.8(D)
printer_tag_end: C67.2 R74.2 U23.14(C) U24.5(2IN+)
printer_tag_end_in: CH18.6 U23.4(K)
printer_tag_end_out: C64.1 R72.2 U24.7(2OUT) ; off-sheet printer_tag_end_out
NetR51_2: R51.2 U20.1(A)
NetR53_2: R53.2 U20.3(A)
NetR57_2: R57.2 R59.2 U21.2(1IN-) U21.6(2IN-)
NetR58_2: R58.2 R61.2 U22.2(1IN-) U22.6(2IN-)
NetR63_2: R63.2 U20.5(A)
NetR65_2: R65.2 U20.7(A)
NetR67_2: R67.2 U23.1(A)
NetR70_2: R70.2 R71.2 U24.2(1IN-) U24.6(2IN-)
NetR73_2: R73.2 U23.3(A)
NetR75_2: R75.2 U23.12(C) U25.4(G)
NetR76_2: R76.2 U23.10(C) U26.4(G)
NetR77_2: R77.2 U23.5(A)
NetR78_2: R78.2 U23.7(A)

### Notes on the sheet
- 打印机故障输入
- 打印机打印结束输入
- 打印机在线输入
- 打印机色带用完输入
- 打印机色带少输入
- 打印机标签用完输入
- 打印机启动打印输出
- 打印机重复启动打印输出
- 打印机24V公共地
- :

### Library data of the parts
C53-C69 = Cap: Capacitor; Published: 8-Jun-2000; LatestRevisionDate: 17-Jul-2002; LatestRevisionNote: Re-released for DXP Platform.; PackageReference: RAD-0.3; Publisher: Altium Limited
R51-R78 = Res2: Resistor; Published: 8-Jun-2000; LatestRevisionDate: 17-Jul-2002; LatestRevisionNote: Re-released for DXP Platform.; PackageReference: AXIAL-0.4; Publisher: Altium Limited
U20 U23 = TLP521-4
U25 U26 = CEM4435A

## Sheet light_key_control.SchDoc
size A3; DocumentNumber: 6; Revision: V1.0; SheetNumber: 6; SheetTotal: 9
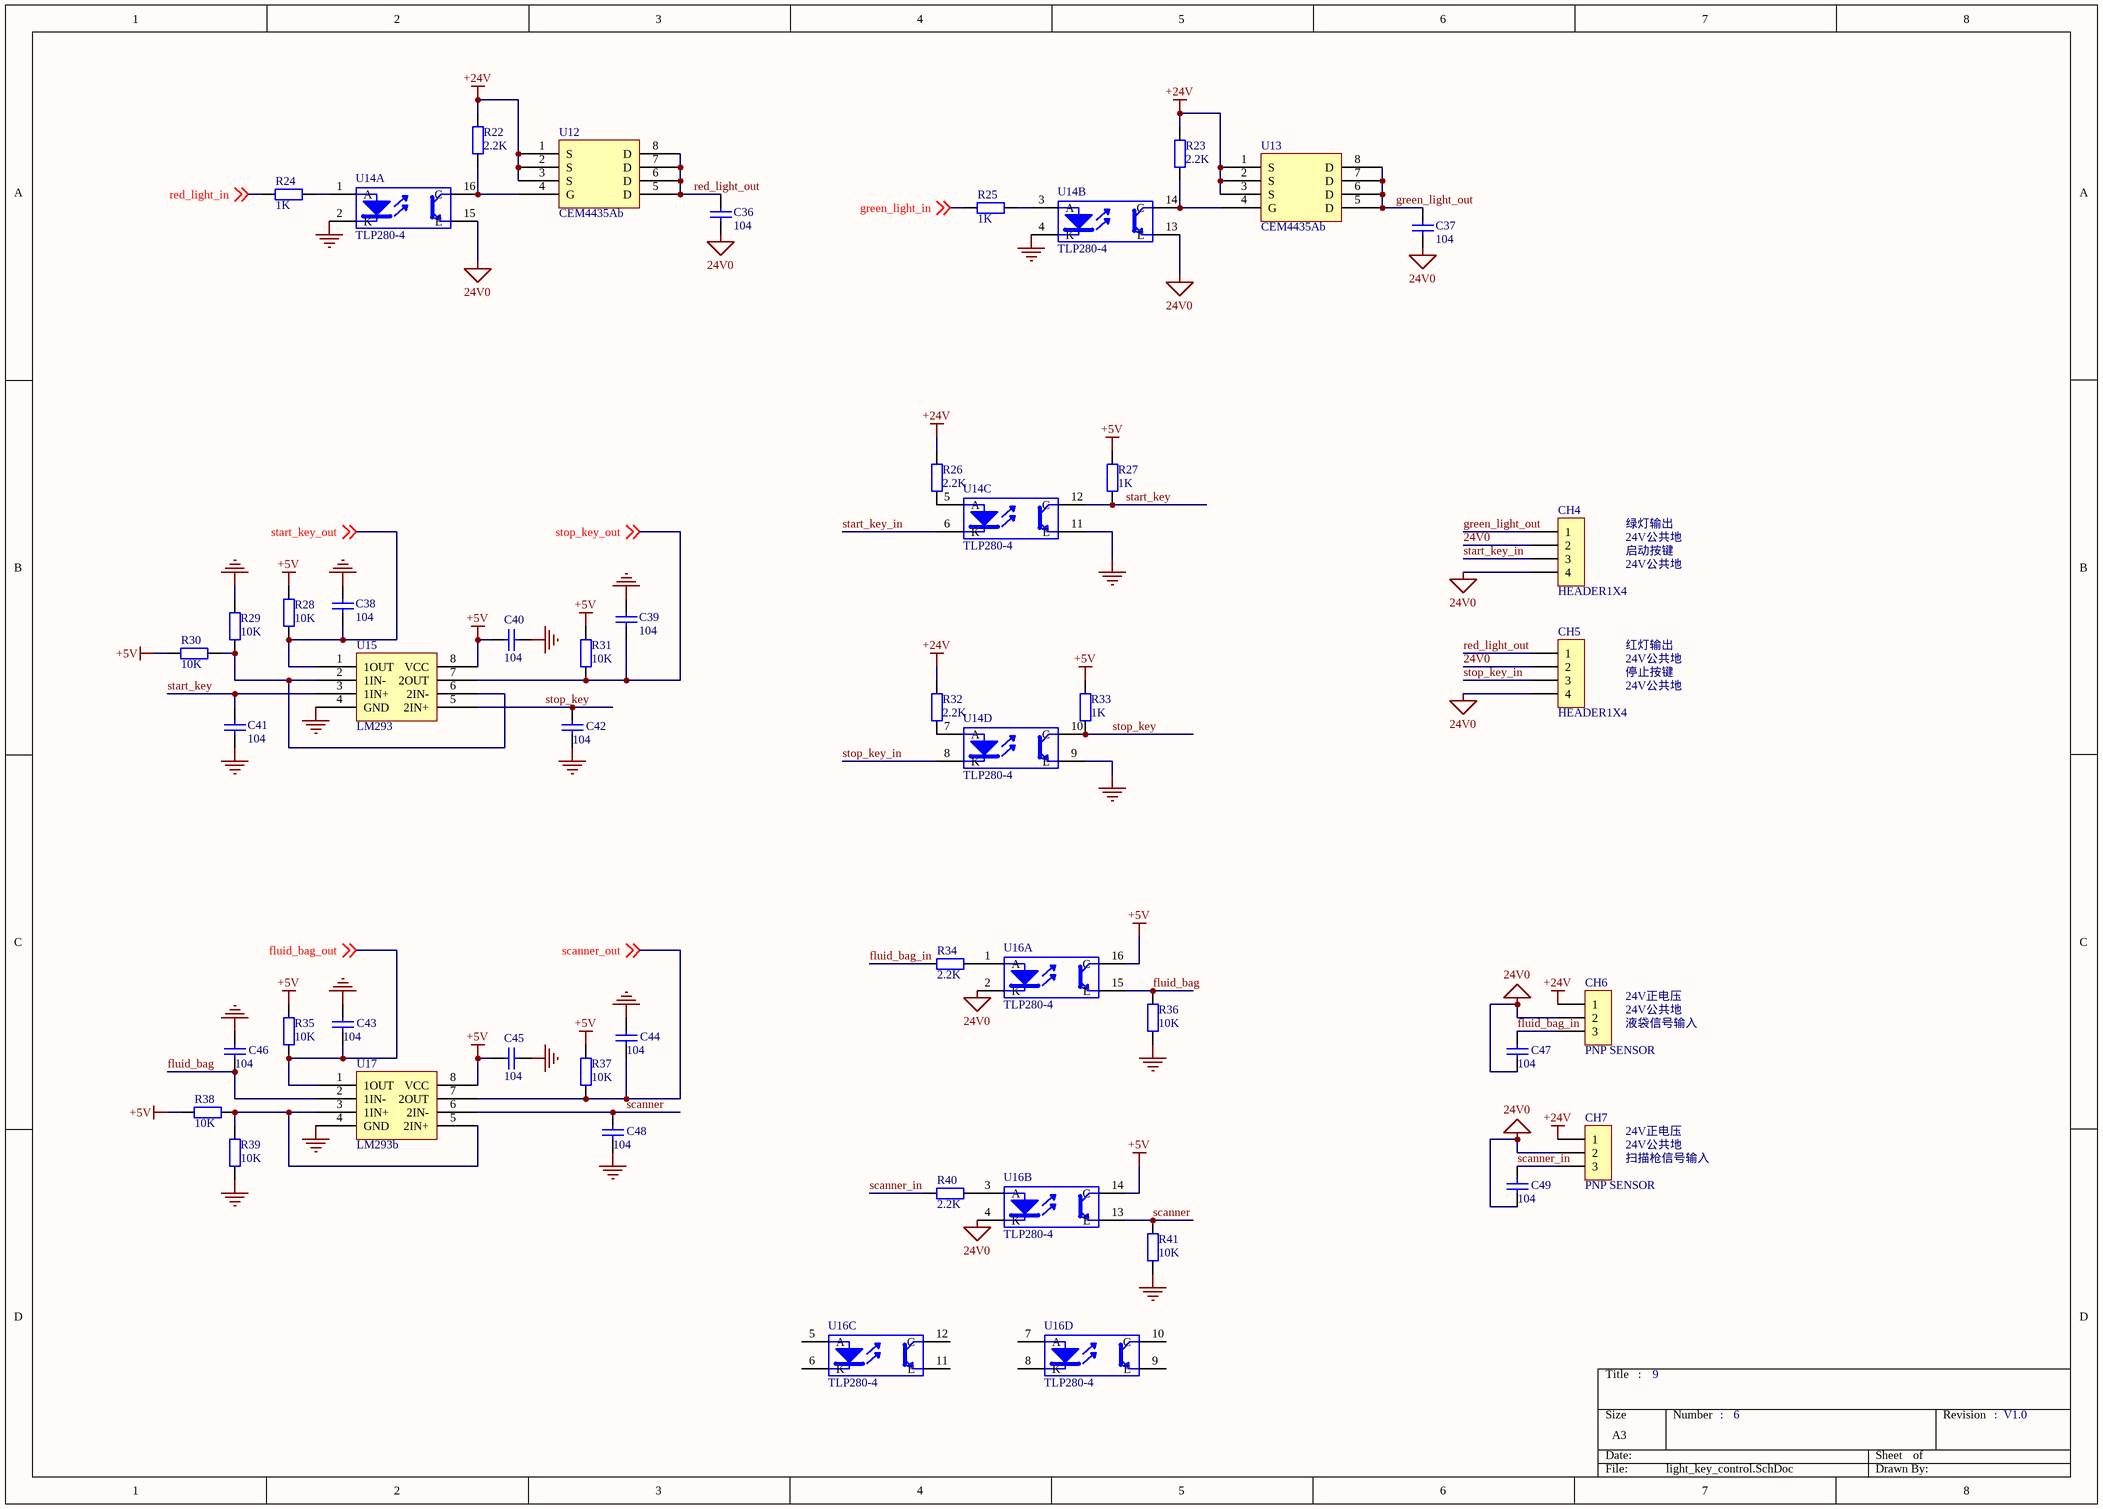
[diagram p6: light_key_control.SchDoc]

### Parts
C36  value 104  [0805]  (hidden comment: Capb)
C37  value 104  [0805]  (hidden comment: Capb)
C38  value 104  [0805]  (hidden comment: Cap)
C39  value 104  [0805]  (hidden comment: Cap)
C40  value 104  [0805]  (hidden comment: Cap)
C41  value 104  [0805]  (hidden comment: Cap)
C42  value 104  [0805]  (hidden comment: Cap)
C43  value 104  [0805]  (hidden comment: Capb)
C44  value 104  [0805]  (hidden comment: Capb)
C45  value 104  [0805]  (hidden comment: Cap)
C46  value 104  [0805]  (hidden comment: Cap)
C47  value 104  [0805]  (hidden comment: Capb)
C48  value 104  [0805]  (hidden comment: Cap)
C49  value 104  [0805]  (hidden comment: Capb)
CH4  HEADER1X4  [CH3.96-4PIN]
CH5  HEADER1X4  [CH3.96-4PIN]
CH6  HEADER1X3  [CH3.96-3PIN]  (value not drawn)
CH7  HEADER1X3  [CH3.96-3PIN]  (value not drawn)
R22  value 2.2K  [0805]  (hidden comment: Res2)
R23  value 2.2K  [0805]  (hidden comment: Res2)
R24  value 1K  [0805]  (hidden comment: Res2)
R25  value 1K  [0805]  (hidden comment: Res2)
R26  value 2.2K  [0805]  (hidden comment: Res2)
R27  value 1K  [0805]  (hidden comment: Res2)
R28  value 10K  [0805]  (hidden comment: Res2)
R29  value 10K  [0805]  (hidden comment: Res2)
R30  value 10K  [0805]  (hidden comment: Res2)
R31  value 10K  [0805]  (hidden comment: Res2)
R32  value 2.2K  [0805]  (hidden comment: Res2)
R33  value 1K  [0805]  (hidden comment: Res2)
R34  value 2.2K  [0805]  (hidden comment: Res2)
R35  value 10K  [0805]  (hidden comment: Res2b)
R36  value 10K  [0805]  (hidden comment: Res2)
R37  value 10K  [0805]  (hidden comment: Res2b)
R38  value 10K  [0805]  (hidden comment: Res2b)
R39  value 10K  [0805]  (hidden comment: Res2b)
R40  value 2.2K  [0805]  (hidden comment: Res2)
R41  value 10K  [0805]  (hidden comment: Res2)
U12  CEM4435Ab  [SOP8-OP27]
U13  CEM4435Ab  [SOP8-OP27]
U14  TLP280-4  [SO16]  (parts A,B,C,D of 4)
U15  LM293  [SOP8-OP27]
U16  TLP280-4  [SO16]  (parts A,B,C,D of 4)
U17  LM293b  [SOP8-OP27]

### Nets
24V0: C36.2 C37.2 C47.1 C49.1 CH4.2 CH4.4 CH5.2 CH5.4 CH6.2 CH7.2 U14.13(E) U14.15(E) U16.2(K) U16.4(K)
+5V: C40.2 C45.2 R27.1 R28.1 R30.1 R31.1 R33.1 R35.1 R37.1 R38.1 U15.8(VCC) U16.14(C) U16.16(C) U17.8(VCC)
+24V: CH6.1 CH7.1 R22.2 R23.2 R26.1 R32.1 U12.1(S) U12.2(S) U12.3(S) U13.1(S) U13.2(S) U13.3(S)
GND: C38.1 C39.1 C40.1 C41.1 C42.1 C43.2 C44.2 C45.1 C46.2 C48.1 R29.1 R36.2 R39.2 R41.2 U14.2(K) U14.4(K) U14.9(E) U14.11(E) U15.4(GND) U17.4(GND)
fluid_bag: C46.1 R36.1 U16.15(E) U17.2(1IN-)
fluid_bag_in: C47.2 CH6.3 R34.1
fluid_bag_out: C43.1 R35.2 U17.1(1OUT) ; off-sheet fluid_bag_out
green_light_in: R25.2 ; off-sheet green_light_in
green_light_out: C37.1 CH4.1 U13.5(D) U13.6(D) U13.7(D) U13.8(D)
red_light_in: R24.2 ; off-sheet red_light_in
red_light_out: C36.1 CH5.1 U12.5(D) U12.6(D) U12.7(D) U12.8(D)
scanner: C48.2 R41.1 U16.13(E) U17.6(2IN-)
scanner_in: C49.2 CH7.3 R40.1
scanner_out: C44.1 R37.2 U17.7(2OUT) ; off-sheet scanner_out
start_key: C41.2 R27.2 U14.12(C) U15.3(1IN+)
start_key_in: CH4.3 U14.6(K)
start_key_out: C38.2 R28.2 U15.1(1OUT) ; off-sheet start_key_out
stop_key: C42.2 R33.2 U14.10(C) U15.5(2IN+)
stop_key_in: CH5.3 U14.8(K)
stop_key_out: C39.2 R31.2 U15.7(2OUT) ; off-sheet stop_key_out
NetR22_1: R22.1 U12.4(G) U14.16(C)
NetR23_1: R23.1 U13.4(G) U14.14(C)
NetR24_1: R24.1 U14.1(A)
NetR25_1: R25.1 U14.3(A)
NetR26_2: R26.2 U14.5(A)
NetR29_2: R29.2 R30.2 U15.2(1IN-) U15.6(2IN-)
NetR32_2: R32.2 U14.7(A)
NetR34_2: R34.2 U16.1(A)
NetR38_2: R38.2 R39.1 U17.3(1IN+) U17.5(2IN+)
NetR40_2: R40.2 U16.3(A)

Not connected (* = marked no-connect by the designer): U16 5(A) 6(K) 7(A) 8(K) 9(E) 10(C) 11(E) 12(C)

### Notes on the sheet
- 绿灯输出
- 24V公共地
- 启动按键
- 红灯输出
- 停止按键
- (near CH6) 液袋信号输入
- (near CH6) 24V公共地
- (near CH6) 24V正电压
- (near CH7) 24V公共地
- (near CH7) 扫描枪信号输入
- (near CH7) 24V正电压
- :
- (in symbol HEADER1X3) PNP SENSOR

### Library data of the parts
C36-C49 = Cap: Capacitor; Published: 8-Jun-2000; LatestRevisionDate: 17-Jul-2002; LatestRevisionNote: Re-released for DXP Platform.; PackageReference: RAD-0.3; Publisher: Altium Limited
R22-R41 = Res2: Resistor; Published: 8-Jun-2000; LatestRevisionDate: 17-Jul-2002; LatestRevisionNote: Re-released for DXP Platform.; PackageReference: AXIAL-0.4; Publisher: Altium Limited
U12 U13 = CEM4435A
U14 U16 = TLP521-4
U17 = LM293

## Sheet power.SchDoc
size A3; DocumentNumber: 2; Revision: V1.0; SheetNumber: 2; SheetTotal: 9
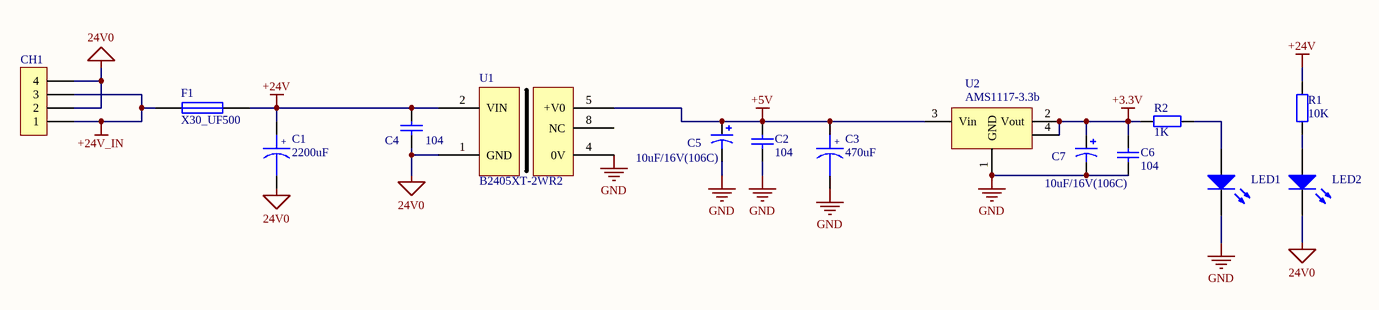
[diagram p7: power.SchDoc]

### Parts
C1  value 2200uF  [C7.8*17]  (hidden comment: C_2200uF)
C2  value 104  [0805]  (hidden comment: Capb)
C3  value 470uF  [C5*10]  (hidden comment: C_2200uF)
C4  value 104  [0805]  (hidden comment: Cap)
C5  value 10uF/16V(106C)  [CAP A-3216]  (hidden comment: Cap Pol3b)
C6  value 104  [0805]  (hidden comment: Capb)
C7  value 10uF/16V(106C)  [CAP A-3216]  (hidden comment: Cap Pol3b)
CH1  HEADER1X4  [CH3.96-4PIN]  (value not drawn)
F1  X30_UF500  [X30UF600]
LED1  (no value)  [LED-0805]
LED2  (no value)  [LED-0805]
R1  value 10K  [0805]  (hidden comment: Res2)
R2  value 1K  [0805]  (hidden comment: Res2)
U1  B2405XT-2WR2  [B2405XT-2WR2]
U2  AMS1117-3.3b  [SOT223]

### Nets
24V0: C1.2 C4.1 CH1.2 CH1.4 LED2.2(K) U1.1(GND)
+3.3V: C6.2 C7.1 R2.2 U2.2(Vout) U2.4
+5V: C2.2 C3.1 C5.1 U1.5(+V0) U2.3(Vin)
+24V: C1.1 C4.2 F1.2 R1.2 U1.2(VIN)
+24V_IN: CH1.1 CH1.3 F1.1
GND: C2.1 C3.2 C5.2 C6.1 C7.2 LED1.2(K) U1.4(0V) U2.1(GND)
NetLED1_1: LED1.1(A) R2.1
NetLED2_1: LED2.1(A) R1.1

Not connected (* = marked no-connect by the designer): U1 8(NC)

### Notes on the sheet
- :
- (in symbol C_2200uF) +

### Library data of the parts
C2 C4 C6 = Cap: Capacitor; Published: 8-Jun-2000; LatestRevisionDate: 17-Jul-2002; LatestRevisionNote: Re-released for DXP Platform.; PackageReference: RAD-0.3; Publisher: Altium Limited
C5 C7 = Cap Pol3: Polarized Capacitor (Surface Mount); Published: 8-Jun-2000; LatestRevisionDate: 17-Jul-2002; LatestRevisionNote: Re-released for DXP Platform.; PackageReference: C0805; Publisher: Altium Limited
F1 = Fuse 1: Fuse; Published: 8-Jun-2000; LatestRevisionDate: 17-Jul-2002; LatestRevisionNote: Re-released for DXP Platform.; PackageReference: PIN-W2/E2.8; Publisher: Altium Limited
LED1 LED2 = LED2: as LED3 on sheet cpu; Published: 8-Jun-2000; LatestRevisionDate: 17-Jul-2002; LatestRevisionNote: Re-released for DXP Platform.; PackageDocument: Feb-2002; PackageReference: 3.2X1.6X1.1; Publisher: Altium Limited
R1 R2 = Res2: Resistor; Published: 8-Jun-2000; LatestRevisionDate: 17-Jul-2002; LatestRevisionNote: Re-released for DXP Platform.; PackageReference: AXIAL-0.4; Publisher: Altium Limited
U2 = AMS1117-5

## Sheet air_cylinder_control.SchDoc
size A3; DocumentNumber: 9; Revision: V1.0; SheetNumber: 9; SheetTotal: 9; Rule: PcbType=ProtelPcb
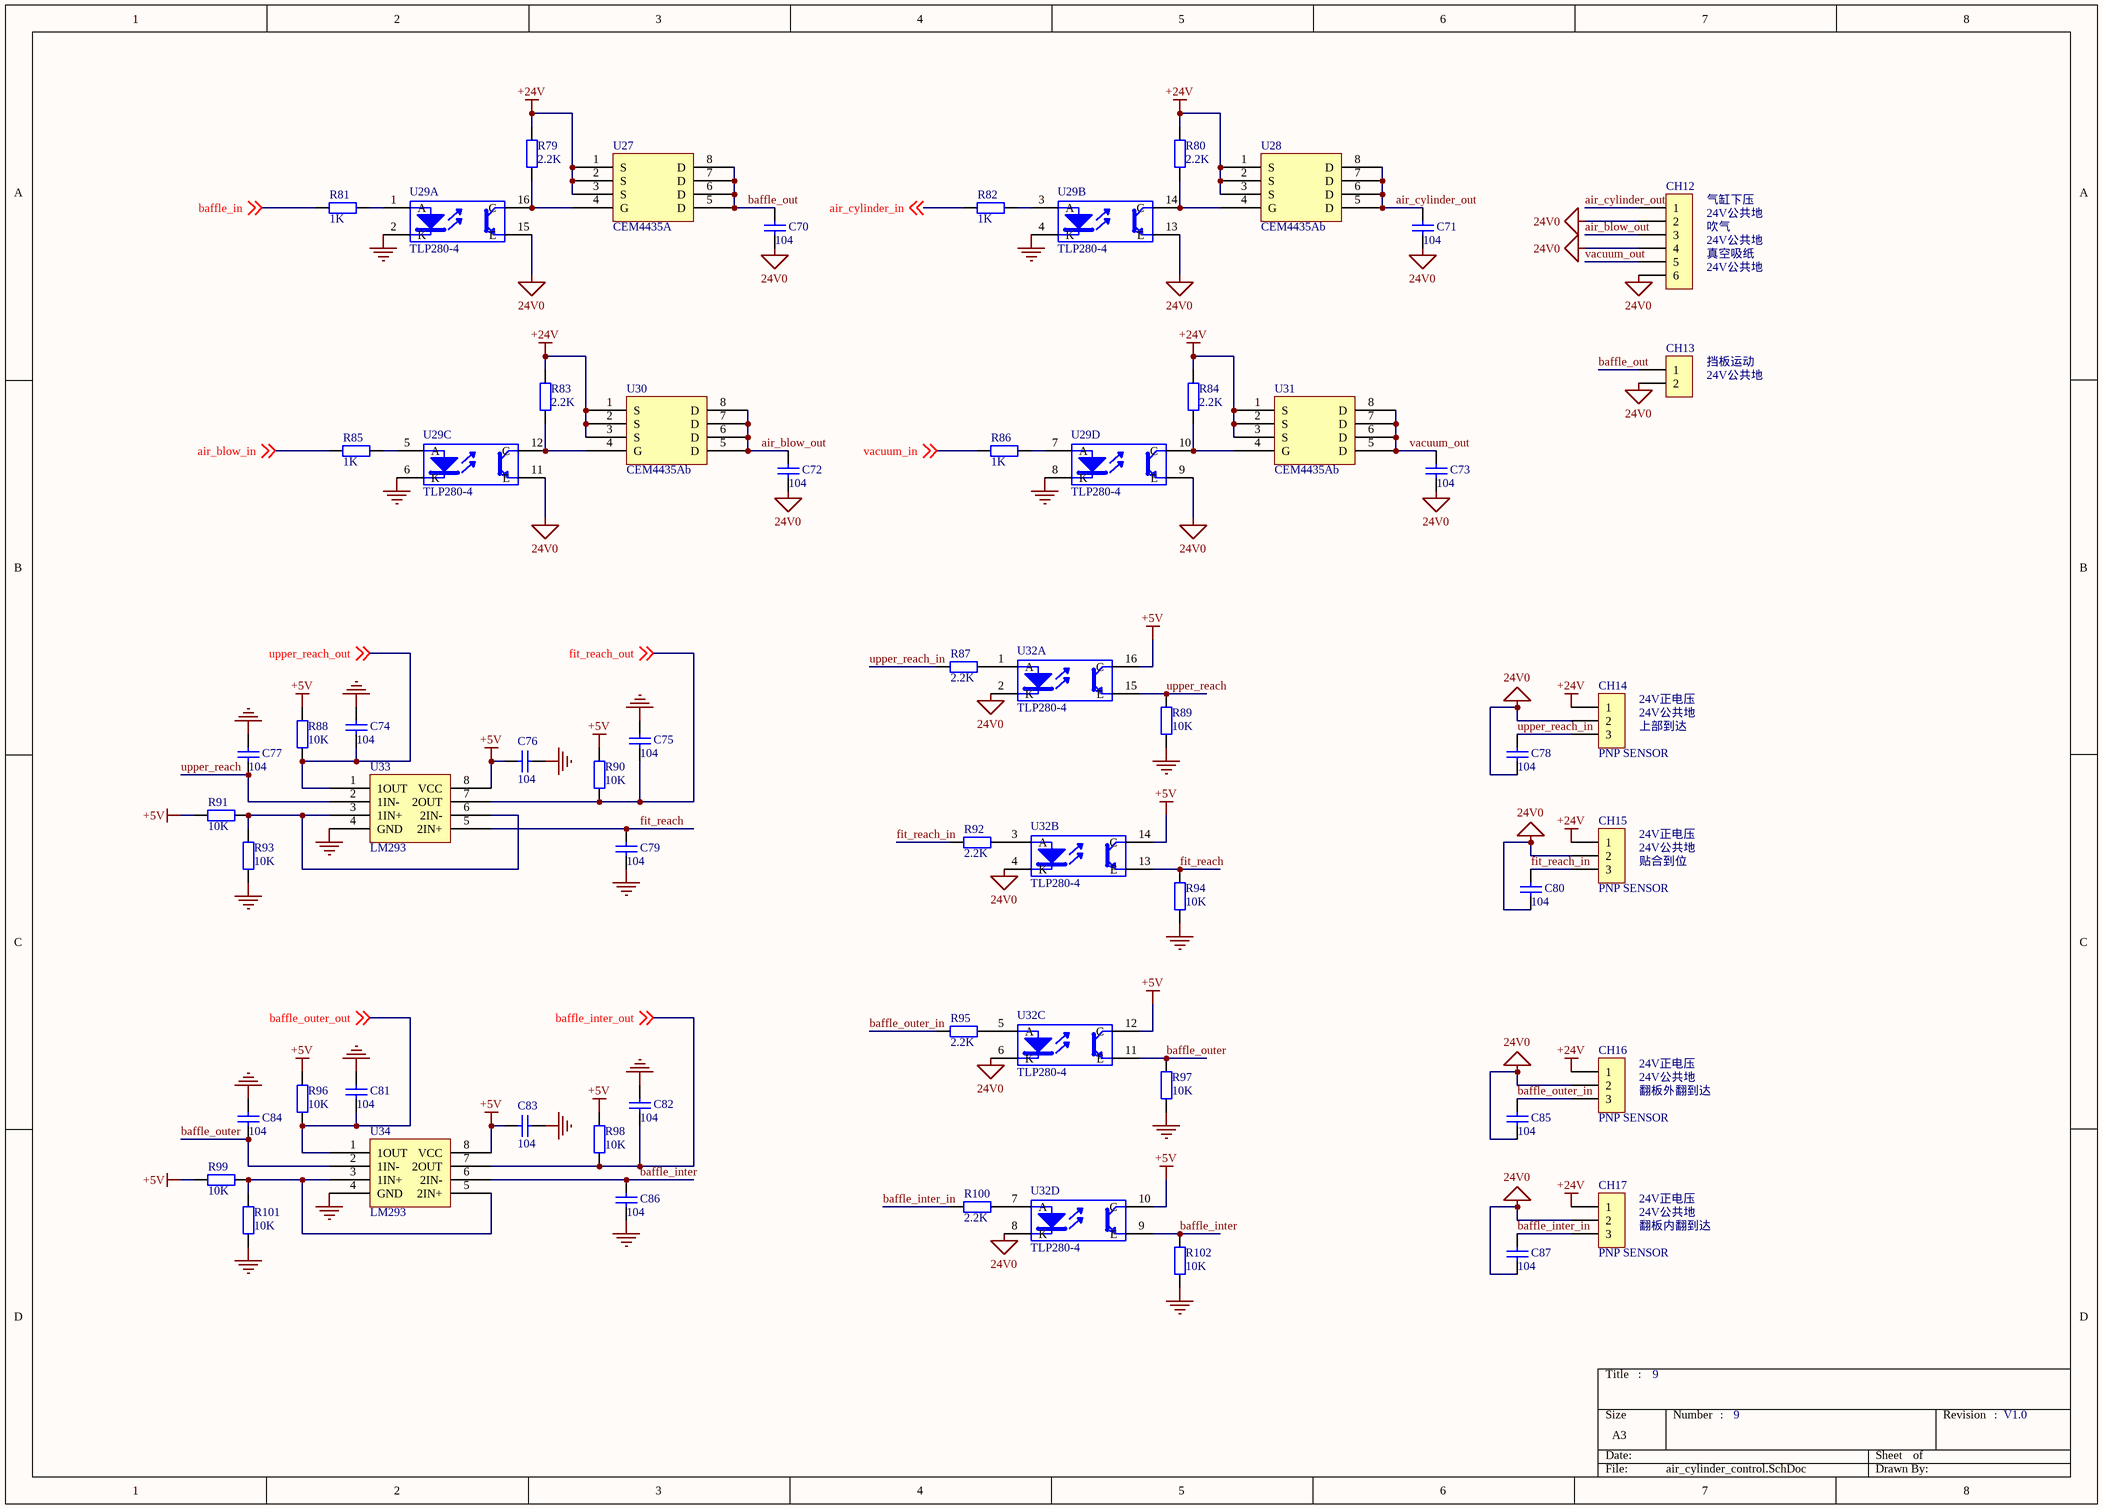
[diagram p8: air_cylinder_control.SchDoc]

### Parts
C70  value 104  [0805]  (hidden comment: Capb)
C71  value 104  [0805]  (hidden comment: Capb)
C72  value 104  [0805]  (hidden comment: Capb)
C73  value 104  [0805]  (hidden comment: Capb)
C74  value 104  [0805]  (hidden comment: Cap)
C75  value 104  [0805]  (hidden comment: Cap)
C76  value 104  [0805]  (hidden comment: Cap)
C77  value 104  [0805]  (hidden comment: Cap)
C78  value 104  [0805]  (hidden comment: Capb)
C79  value 104  [0805]  (hidden comment: Cap)
C80  value 104  [0805]  (hidden comment: Capb)
C81  value 104  [0805]  (hidden comment: Cap)
C82  value 104  [0805]  (hidden comment: Cap)
C83  value 104  [0805]  (hidden comment: Cap)
C84  value 104  [0805]  (hidden comment: Cap)
C85  value 104  [0805]  (hidden comment: Capb)
C86  value 104  [0805]  (hidden comment: Cap)
C87  value 104  [0805]  (hidden comment: Capb)
CH12  HEADER1X6  [CH3.96-6PIN]  (value not drawn)
CH13  HEADER1X2  [CH3.96-2PIN]  (value not drawn)
CH14  HEADER1X3  [CH3.96-3PIN]  (value not drawn)
CH15  HEADER1X3  [CH3.96-3PIN]  (value not drawn)
CH16  HEADER1X3  [CH3.96-3PIN]  (value not drawn)
CH17  HEADER1X3  [CH3.96-3PIN]  (value not drawn)
R79  value 2.2K  [0805]  (hidden comment: Res2)
R80  value 2.2K  [0805]  (hidden comment: Res2)
R81  value 1K  [0805]  (hidden comment: Res2)
R82  value 1K  [0805]  (hidden comment: Res2)
R83  value 2.2K  [0805]  (hidden comment: Res2)
R84  value 2.2K  [0805]  (hidden comment: Res2)
R85  value 1K  [0805]  (hidden comment: Res2)
R86  value 1K  [0805]  (hidden comment: Res2)
R87  value 2.2K  [0805]  (hidden comment: Res2)
R88  value 10K  [0805]  (hidden comment: Res2)
R89  value 10K  [0805]  (hidden comment: Res2)
R90  value 10K  [0805]  (hidden comment: Res2)
R91  value 10K  [0805]  (hidden comment: Res2)
R92  value 2.2K  [0805]  (hidden comment: Res2)
R93  value 10K  [0805]  (hidden comment: Res2)
R94  value 10K  [0805]  (hidden comment: Res2)
R95  value 2.2K  [0805]  (hidden comment: Res2)
R96  value 10K  [0805]  (hidden comment: Res2)
R97  value 10K  [0805]  (hidden comment: Res2)
R98  value 10K  [0805]  (hidden comment: Res2)
R99  value 10K  [0805]  (hidden comment: Res2)
R100  value 2.2K  [0805]  (hidden comment: Res2)
R101  value 10K  [0805]  (hidden comment: Res2)
R102  value 10K  [0805]  (hidden comment: Res2)
U27  CEM4435A  [SOP8-OP27]
U28  CEM4435Ab  [SOP8-OP27]
U29  TLP280-4  [SO16]  (parts A,B,C,D of 4)
U30  CEM4435Ab  [SOP8-OP27]
U31  CEM4435Ab  [SOP8-OP27]
U32  TLP280-4  [SO16]  (parts A,B,C,D of 4)
U33  LM293  [SOP8-OP27]
U34  LM293  [SOP8-OP27]

### Nets
24V0: C70.1 C71.1 C72.1 C73.1 C78.1 C80.1 C85.1 C87.1 CH12.2 CH12.4 CH12.6 CH13.2 CH14.2 CH15.2 CH16.2 CH17.2 U29.9(E) U29.11(E) U29.13(E) U29.15(E) U32.2(K) U32.4(K) U32.6(K) U32.8(K)
+5V: C76.2 C83.2 R88.2 R90.2 R91.2 R96.2 R98.2 R99.2 U32.10(C) U32.12(C) U32.14(C) U32.16(C) U33.8(VCC) U34.8(VCC)
+24V: CH14.1 CH15.1 CH16.1 CH17.1 R79.1 R80.1 R83.1 R84.1 U27.1(S) U27.2(S) U27.3(S) U28.1(S) U28.2(S) U28.3(S) U30.1(S) U30.2(S) U30.3(S) U31.1(S) U31.2(S) U31.3(S)
GND: C74.2 C75.2 C76.1 C77.2 C79.1 C81.2 C82.2 C83.1 C84.2 C86.1 R89.1 R93.1 R94.1 R97.1 R101.1 R102.1 U29.2(K) U29.4(K) U29.6(K) U29.8(K) U33.4(GND) U34.4(GND)
air_blow_in: R85.1 ; off-sheet air_blow_in
air_blow_out: C72.2 CH12.3 U30.5(D) U30.6(D) U30.7(D) U30.8(D)
air_cylinder_in: R82.1 ; off-sheet air_cylinder_in
air_cylinder_out: C71.2 CH12.1 U28.5(D) U28.6(D) U28.7(D) U28.8(D)
baffle_in: R81.1 ; off-sheet baffle_in  [project net CPU1_FOR_CPU2_2]
baffle_inter: C86.2 R102.2 U32.9(E) U34.6(2IN-)
baffle_inter_in: C87.2 CH17.3 R100.1
baffle_inter_out: C82.1 R98.1 U34.7(2OUT) ; off-sheet baffle_inter_out  [project net CPU1_FOR_CPU2_1]
baffle_out: C70.2 CH13.1 U27.5(D) U27.6(D) U27.7(D) U27.8(D)
baffle_outer: C84.1 R97.2 U32.11(E) U34.2(1IN-)
baffle_outer_in: C85.2 CH16.3 R95.1
baffle_outer_out: C81.1 R96.1 U34.1(1OUT) ; off-sheet baffle_outer_out  [project net CPU1_FOR_CPU2_3]
fit_reach: C79.2 R94.2 U32.13(E) U33.5(2IN+)
fit_reach_in: C80.2 CH15.3 R92.1
fit_reach_out: C75.1 R90.1 U33.7(2OUT) ; off-sheet fit_reach_out
upper_reach: C77.1 R89.2 U32.15(E) U33.2(1IN-)
upper_reach_in: C78.2 CH14.3 R87.1
upper_reach_out: C74.1 R88.1 U33.1(1OUT) ; off-sheet upper_reach_out
vacuum_in: R86.1 ; off-sheet vacuum_in
vacuum_out: C73.2 CH12.5 U31.5(D) U31.6(D) U31.7(D) U31.8(D)
NetR79_2: R79.2 U27.4(G) U29.16(C)
NetR80_2: R80.2 U28.4(G) U29.14(C)
NetR81_2: R81.2 U29.1(A)
NetR82_2: R82.2 U29.3(A)
NetR83_2: R83.2 U29.12(C) U30.4(G)
NetR84_2: R84.2 U29.10(C) U31.4(G)
NetR85_2: R85.2 U29.5(A)
NetR86_2: R86.2 U29.7(A)
NetR87_2: R87.2 U32.1(A)
NetR91_1: R91.1 R93.2 U33.3(1IN+) U33.6(2IN-)
NetR92_2: R92.2 U32.3(A)
NetR95_2: R95.2 U32.5(A)
NetR99_1: R99.1 R101.2 U34.3(1IN+) U34.5(2IN+)
NetR100_2: R100.2 U32.7(A)

### Notes on the sheet
- (near CH12) 气缸下压
- (near CH12) 吹气
- (near CH12) 24V公共地
- (near CH12) 真空吸纸
- (near CH13) 挡板运动
- (near CH13) 24V公共地
- (near CH14) 24V公共地
- (near CH14) 24V正电压
- (near CH14) 上部到达
- (near CH15) 24V公共地
- (near CH15) 24V正电压
- (near CH15) 贴合到位
- (near CH16) 翻板外翻到达
- (near CH16) 24V公共地
- (near CH16) 24V正电压
- (near CH17) 24V公共地
- (near CH17) 翻板内翻到达
- (near CH17) 24V正电压
- :
- (in symbol HEADER1X3) PNP SENSOR

### Library data of the parts
C70-C87 = Cap: Capacitor; Published: 8-Jun-2000; LatestRevisionDate: 17-Jul-2002; LatestRevisionNote: Re-released for DXP Platform.; PackageReference: RAD-0.3; Publisher: Altium Limited
R79-R102 = Res2: Resistor; Published: 8-Jun-2000; LatestRevisionDate: 17-Jul-2002; LatestRevisionNote: Re-released for DXP Platform.; PackageReference: AXIAL-0.4; Publisher: Altium Limited
U28 U30 U31 = CEM4435A
U29 U32 = TLP521-4

## Nets that join several sheets
24V0: roll_motorl_control (10 pins), belt_motor_control (8 pins), printer_control (6 pins), light_key_control (14 pins), power (6 pins), air_cylinder_control (24 pins)
+3.3V: cpu (12 pins), communition (5 pins), power (5 pins)
+5V: roll_motorl_control (6 pins), belt_motor_control (5 pins), printer_control (21 pins), light_key_control (14 pins), power (5 pins), air_cylinder_control (14 pins)
+24V: roll_motorl_control (6 pins), belt_motor_control (10 pins), printer_control (14 pins), light_key_control (12 pins), power (5 pins), air_cylinder_control (20 pins)
GND: cpu (14 pins), roll_motorl_control (5 pins), belt_motor_control (8 pins), communition (C20#2.1 C22#2.2 U5.10), printer_control (29 pins), light_key_control (20 pins), power (8 pins), air_cylinder_control (22 pins)
air_blow_in: cpu (U3.51), air_cylinder_control (R85.1)
air_cylinder_in: cpu (U3.52), air_cylinder_control (R82.1)
CPU1_FOR_CPU2_1: cpu (U3.44), air_cylinder_control (C82.1 R98.1 U34.7)
CPU1_FOR_CPU2_2: cpu (U3.45), air_cylinder_control (R81.1)
CPU1_FOR_CPU2_3: cpu (U3.61), air_cylinder_control (C81.1 R96.1 U34.1)
CPU1_NET_RST: cpu (U3.41), communition (U5.4)
CPU1_USART1_RXD: cpu (U3.43), communition (U5.9)
CPU1_USART1_TXD: cpu (U3.42), communition (U5.8)
cpu_control_roll: cpu (U3.23), roll_motorl_control (R46.2 R47.1 U19.5)
DIR11_in: cpu (U3.59), belt_motor_control (R16#2.1)
ERR11_out: cpu (U3.57), belt_motor_control (C33.1 R18.2 U11.1)
fit_reach_out: cpu (U3.40), air_cylinder_control (C75.1 R90.1 U33.7)
fluid_bag_out: cpu (U3.38), light_key_control (C43.1 R35.2 U17.1)
green_light_in: cpu (U3.20), light_key_control (R25.2)
printer_color_end_out: cpu (U3.33), printer_control (C53.1 R60.2 U21.7)
printer_color_less_out: cpu (U3.29), printer_control (C63.1 R69.2 U24.1)
printer_end_out: cpu (U3.35), printer_control (C54.1 R62.2 U22.7)
printer_err_out: cpu (U3.34), printer_control (C56.1 R56.2 U22.1)
printer_inline_out: cpu (U3.30), printer_control (C55.1 R55.2 U21.1)
printer_restart_in: cpu (U3.24), printer_control (R78.1)
printer_start_in: cpu (U3.25), printer_control (R77.1)
printer_tag_end_out: cpu (U3.36), printer_control (C64.1 R72.2 U24.7)
red_light_in: cpu (U3.17), light_key_control (R24.2)
scanner_out: cpu (U3.37), light_key_control (C44.1 R37.2 U17.7)
SPEED11_in: cpu (U3.58), belt_motor_control (R14#1.1)
start_key_out: cpu (U3.22), light_key_control (C38.2 R28.2 U15.1)
stop_key_out: cpu (U3.21), light_key_control (C39.2 R31.2 U15.7)
upper_reach_out: cpu (U3.39), air_cylinder_control (C74.1 R88.1 U33.1)
vacuum_in: cpu (U3.53), air_cylinder_control (R86.1)